# EAGLE schematic SOM204-EVB_Rev_C (EAGLE 4.16)
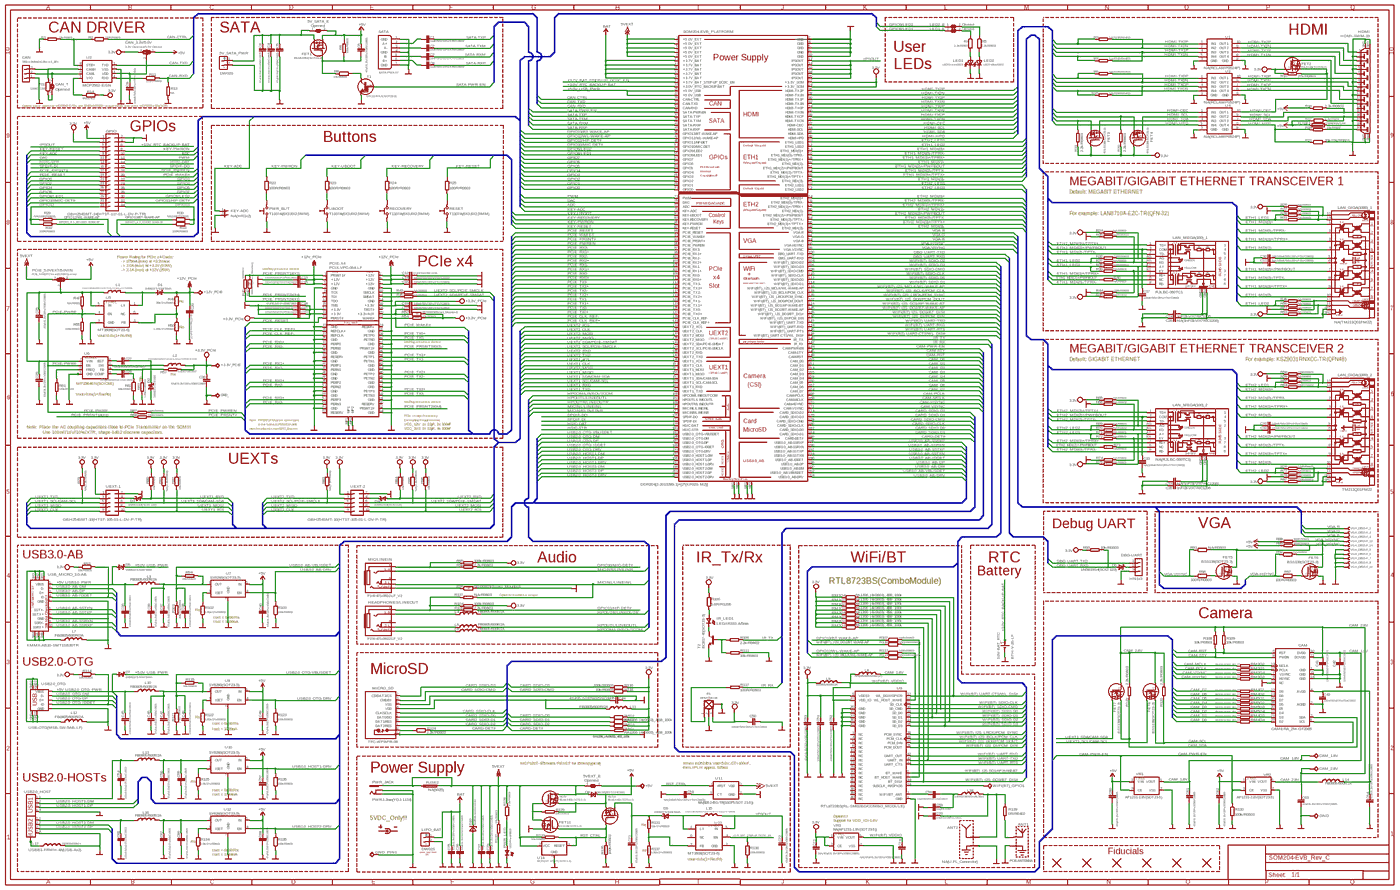
[diagram p0: schematic, sheet 1, overview]
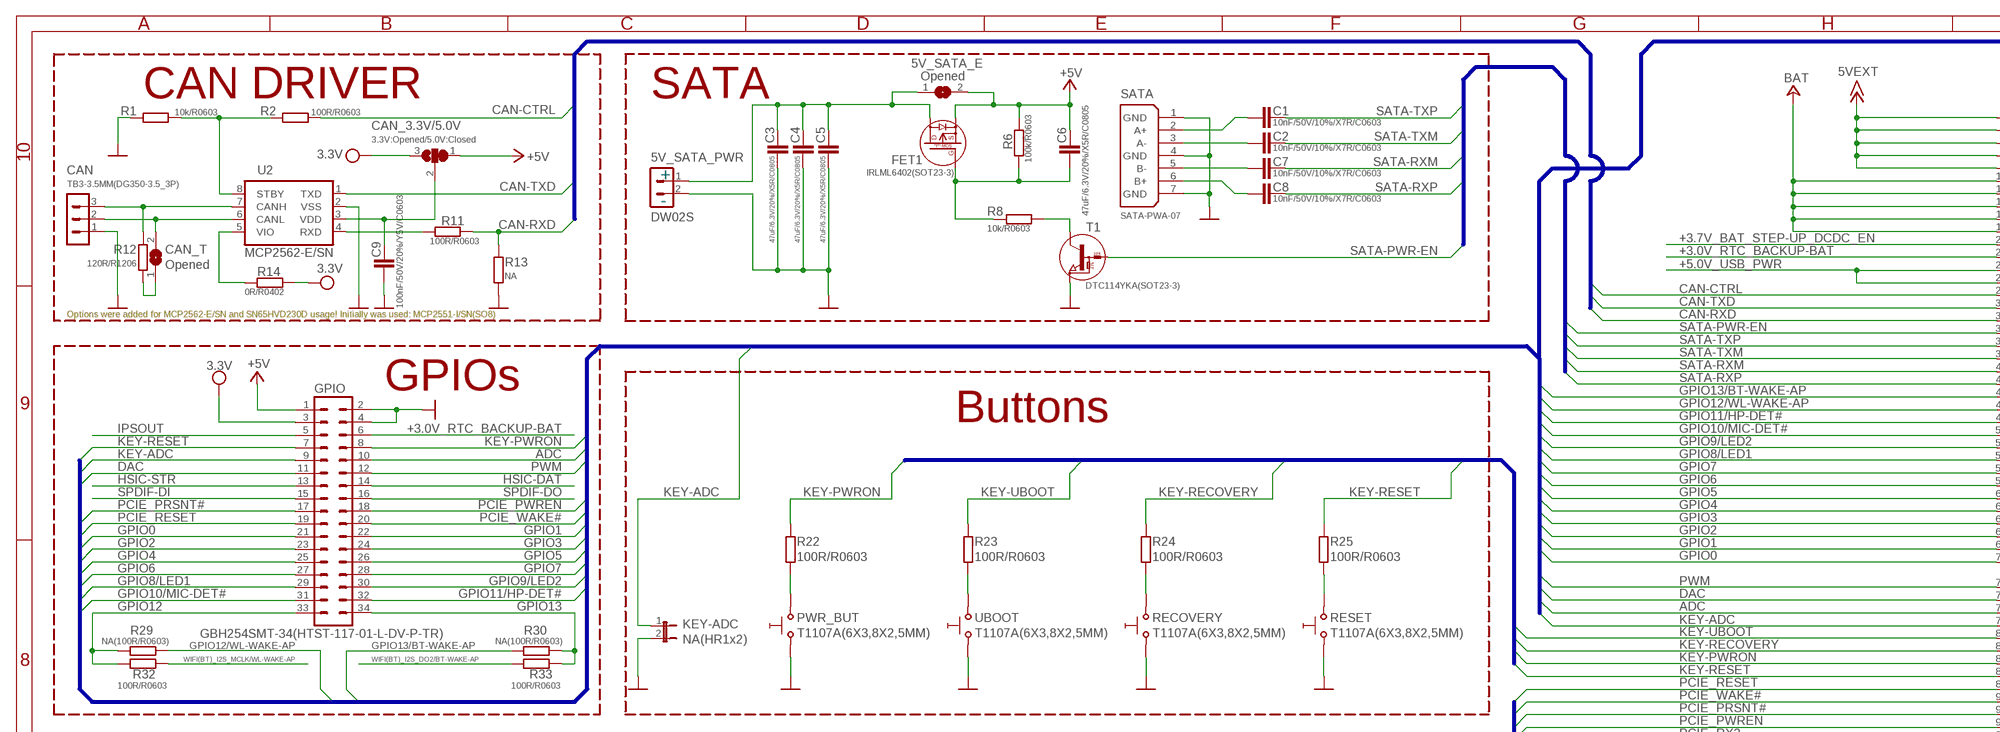
[diagram p1: schematic, sheet 1, part 1 of 4]
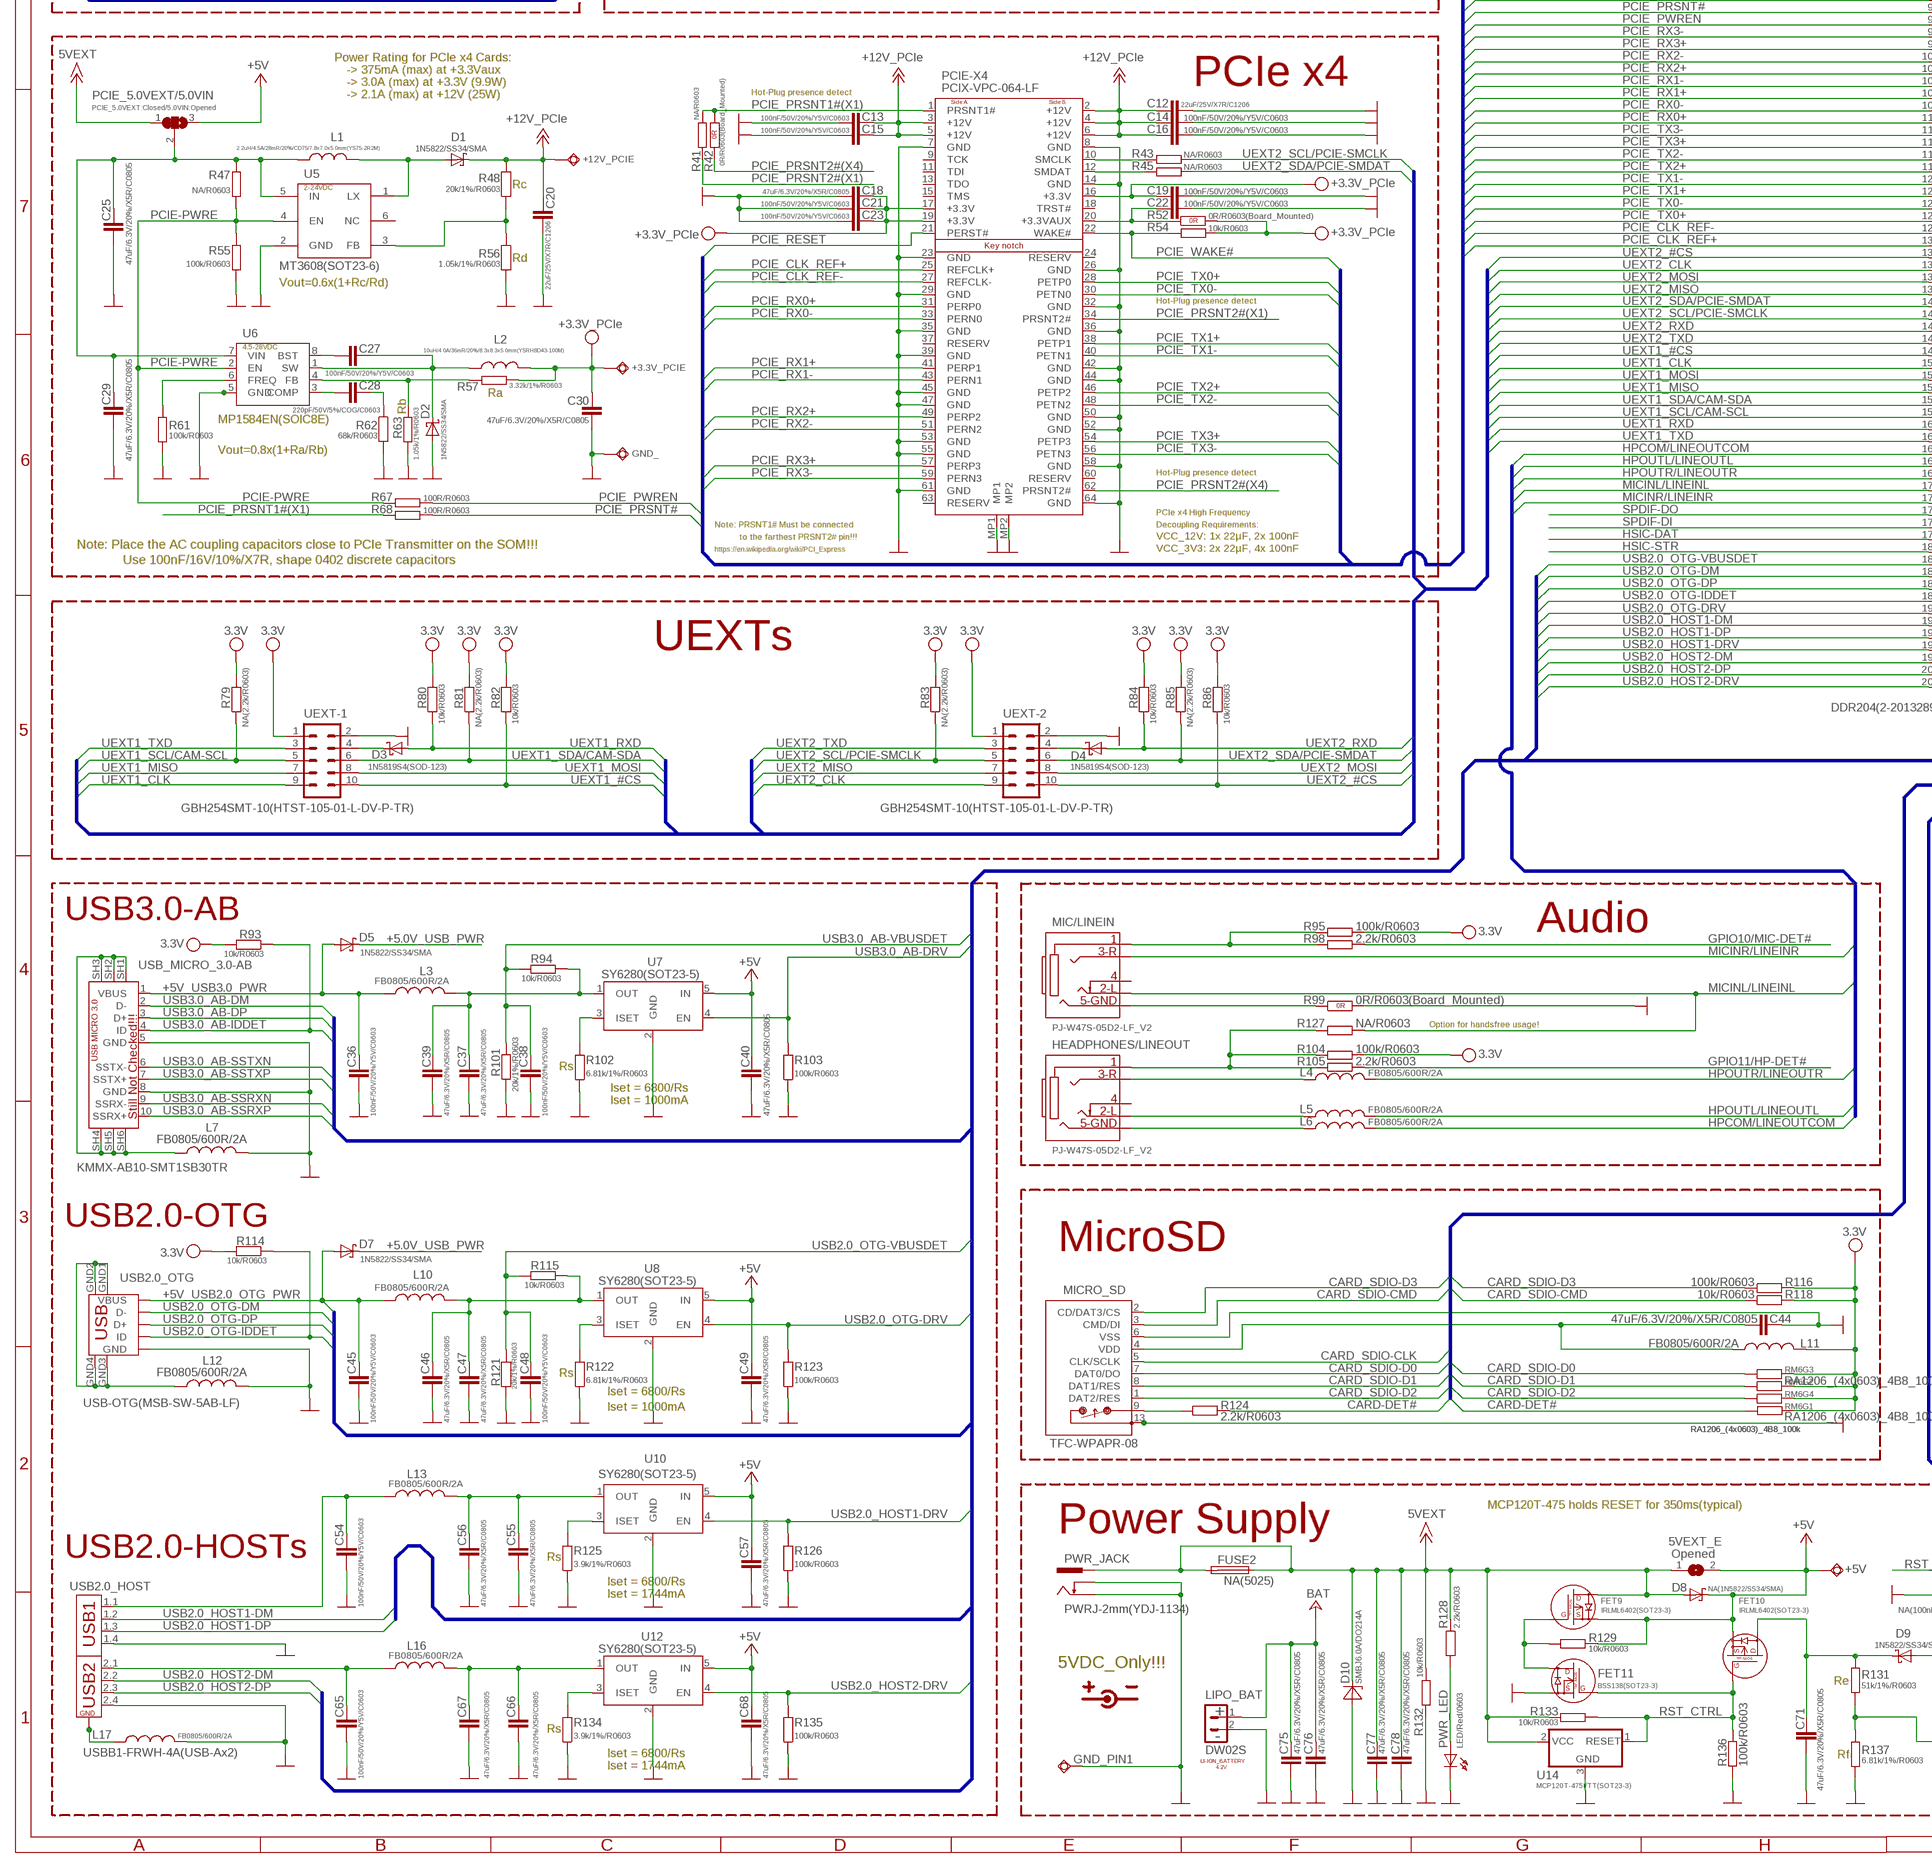
[diagram p2: schematic, sheet 1, part 2 of 4]
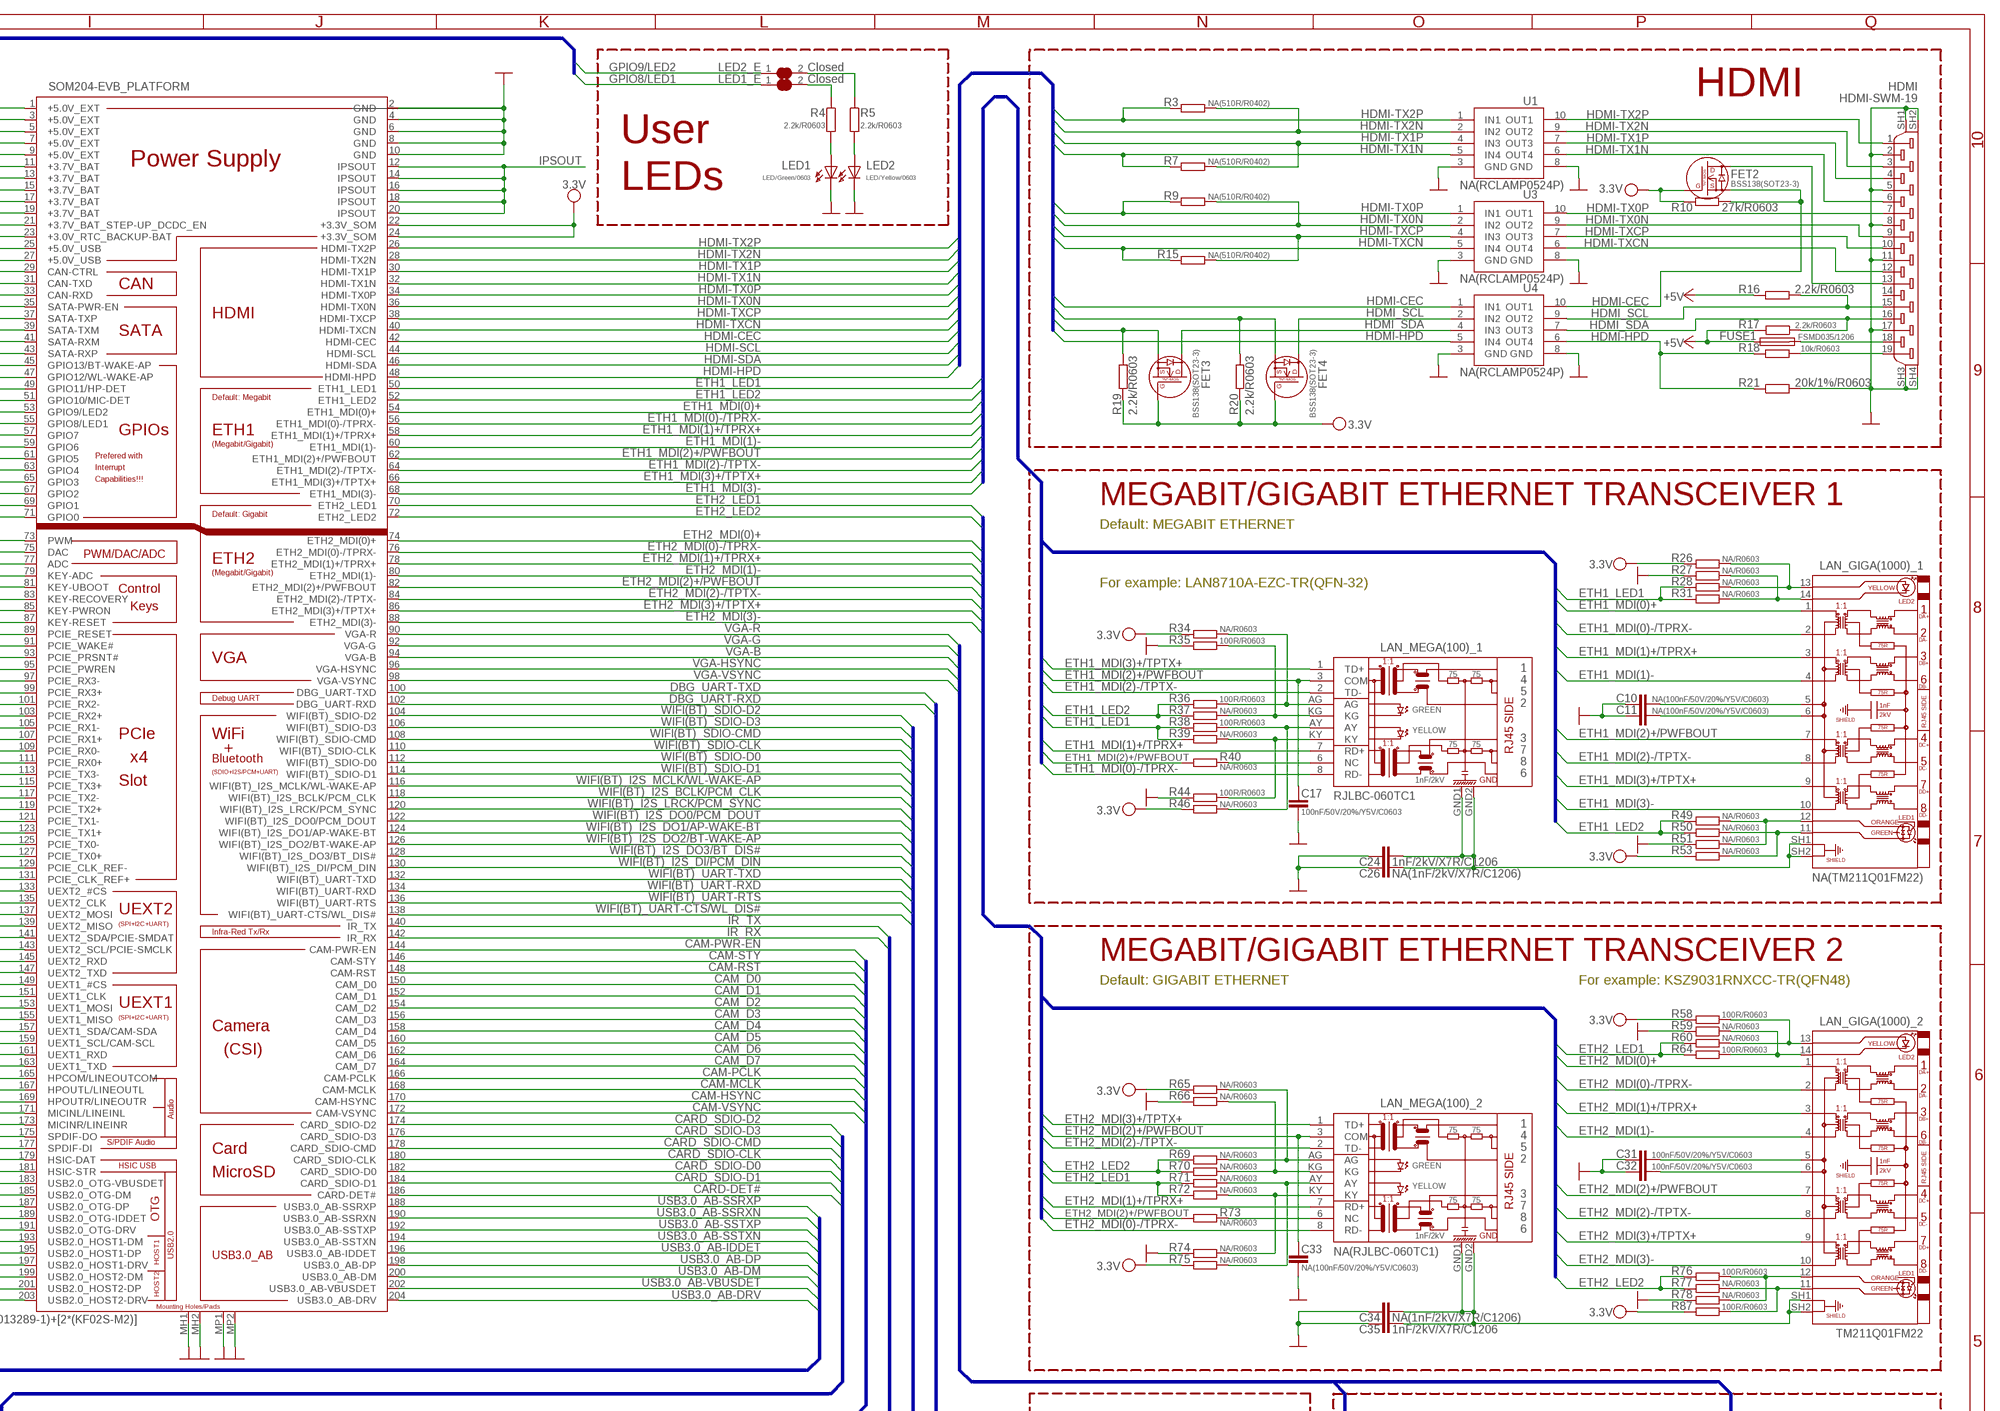
[diagram p3: schematic, sheet 1, part 3 of 4]
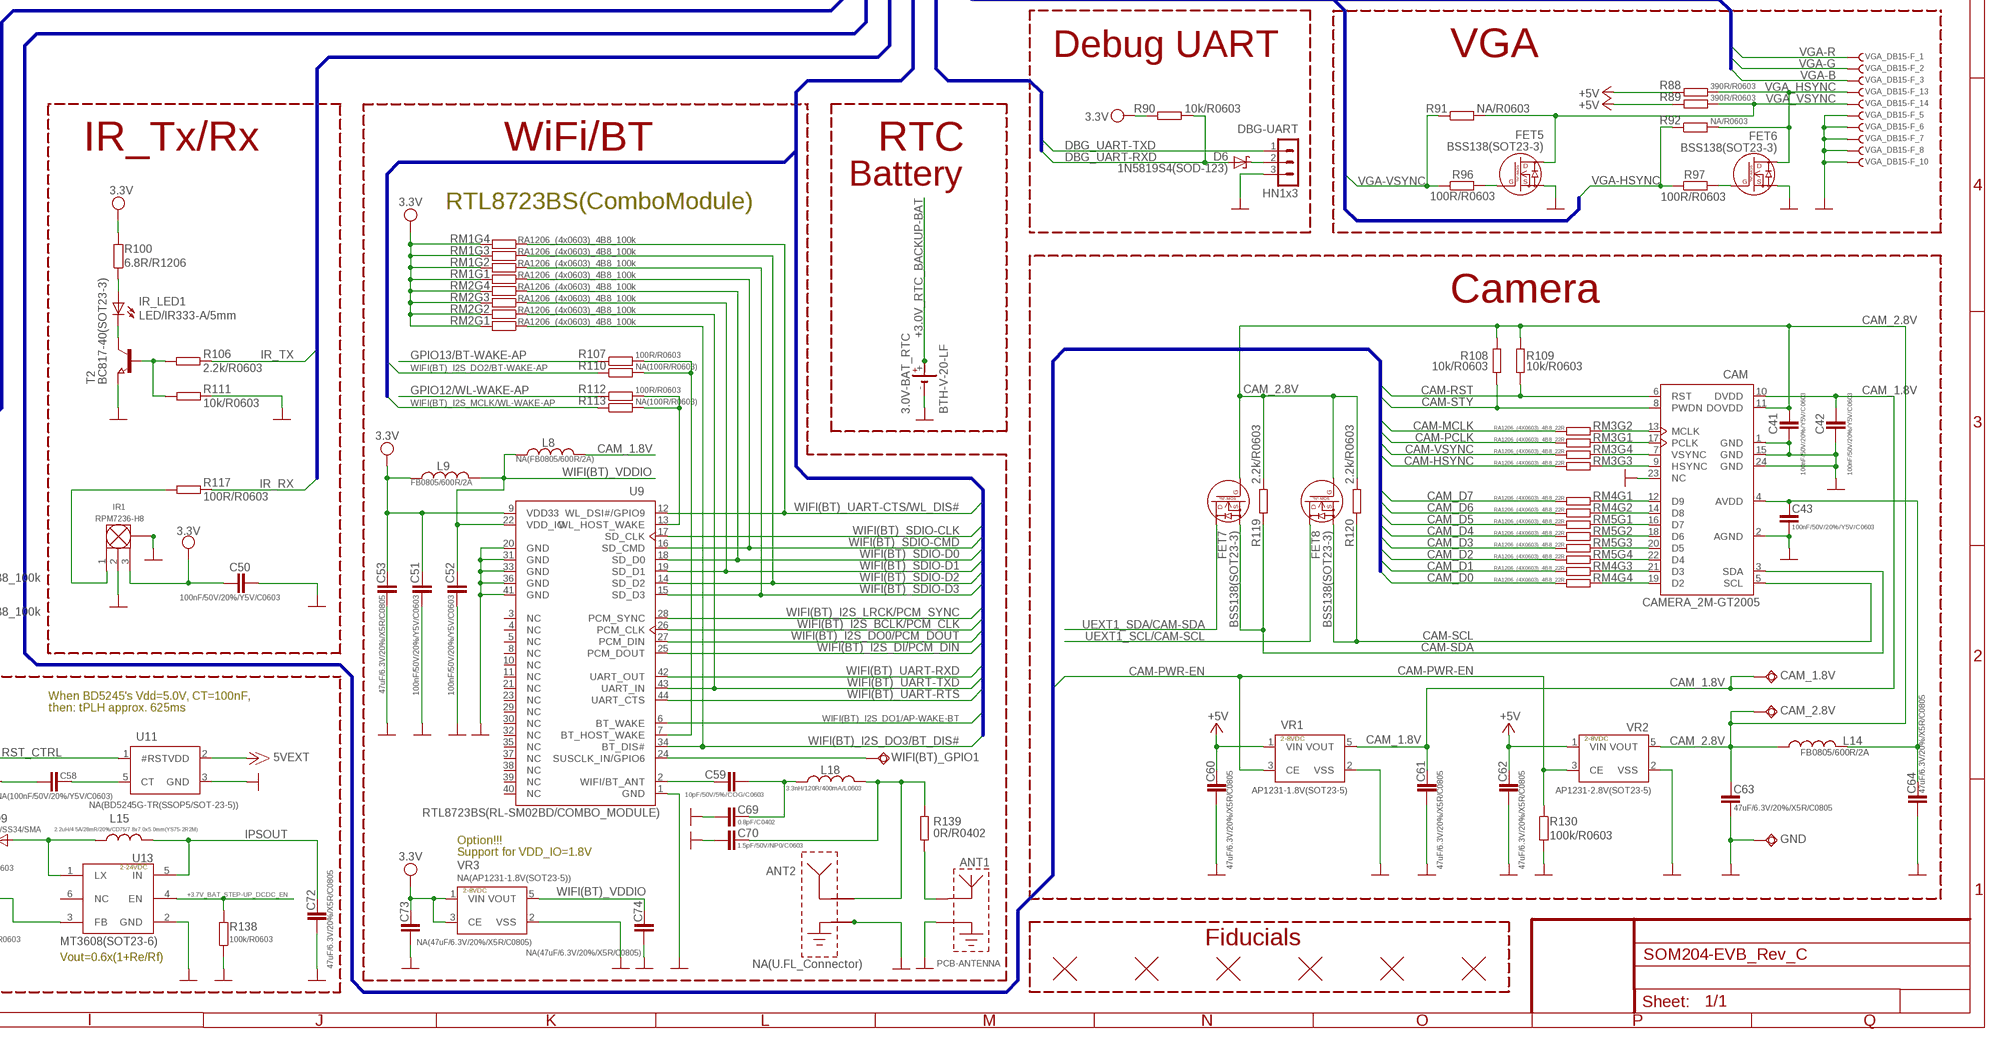
[diagram p4: schematic, sheet 1, part 4 of 4]

## Parts
3.0V-BAT_RTC  BTH-V-20-LF  BBTH-V-20-LF  [3V_BAT_HOLDER]
5V_SATA_E  Opened  SJ  [SJ]
5V_SATA_PWR  DW02S  CON2DW02S  [DW02S]
5VEXT_E  Opened  SJ  [SJ]
+3.3V_PCIE  TESTPADTESTPAD_40-ROUND  [TESTPAD_40-ROUND]
+5V  TESTPADTESTPAD_40-ROUND  [TESTPAD_40-ROUND]
+12V_PCIE  TESTPADTESTPAD_40-ROUND  [TESTPAD_40-ROUND]
ANT1  PCB-ANTENNA  ANTENNA_GNDM  [SMAL_SIZE-2.4GHZ_PCB_ANTENNA_MIRROR]
ANT2  NA(U.FL_Connector)  RF_CON  [RF_CONNECTOR_I-PEX]
C1  10nF/50V/10%/X7R/C0603  C-EUC0603_DWS  [C0603_DWS]
C2  10nF/50V/10%/X7R/C0603  C-EUC0603_DWS  [C0603_DWS]
C3  47uF/6.3V/20%/X5R/C0805  C-EUC0805_5MIL_DWS  [C0805_5MIL_DWS]
C4  47uF/6.3V/20%/X5R/C0805  C-EUC0805_5MIL_DWS  [C0805_5MIL_DWS]
C5  47uF/6.3V/20%/X5R/C0805  C-EUC0805_5MIL_DWS  [C0805_5MIL_DWS]
C6  47uF/6.3V/20%/X5R/C0805  C-EUC0805_5MIL_DWS  [C0805_5MIL_DWS]
C7  10nF/50V/10%/X7R/C0603  C-EUC0603_DWS  [C0603_DWS]
C8  10nF/50V/10%/X7R/C0603  C-EUC0603_DWS  [C0603_DWS]
C9  100nF/50V/20%/Y5V/C0603  C-EUC0603_DWS  [C0603_DWS]
C10  NA(100nF/50V/20%/Y5V/C0603)  C-EUC0603_DWS  [C0603_DWS]
C11  NA(100nF/50V/20%/Y5V/C0603)  C-EUC0603_DWS  [C0603_DWS]
C12  22uF/25V/X7R/C1206  C-EUC1206_5MIL_WS  [C1206_5MIL_WS]
C13  100nF/50V/20%/Y5V/C0603  C-EUC0603_DWS  [C0603_DWS]
C14  100nF/50V/20%/Y5V/C0603  C-EUC0603_DWS  [C0603_DWS]
C15  100nF/50V/20%/Y5V/C0603  C-EUC0603_DWS  [C0603_DWS]
C16  100nF/50V/20%/Y5V/C0603  C-EUC0603_DWS  [C0603_DWS]
C17  100nF/50V/20%/Y5V/C0603  C-EUC0603_DWS  [C0603_DWS]
C18  47uF/6.3V/20%/X5R/C0805  C-EUC0805_5MIL_DWS  [C0805_5MIL_DWS]
C19  100nF/50V/20%/Y5V/C0603  C-EUC0603_DWS  [C0603_DWS]
C20  22uF/25V/X7R/C1206  C-EUC1206_5MIL_WS  [C1206_5MIL_WS]
C21  100nF/50V/20%/Y5V/C0603  C-EUC0603_DWS  [C0603_DWS]
C22  100nF/50V/20%/Y5V/C0603  C-EUC0603_DWS  [C0603_DWS]
C23  100nF/50V/20%/Y5V/C0603  C-EUC0603_DWS  [C0603_DWS]
C24  1nF/2kV/X7R/C1206  C-EUC1206_5MILS_WS_ISO  [C1206_5MILS_WS_ISO]
C25  47uF/6.3V/20%/X5R/C0805  C-EUC0805_5MIL_DWS  [C0805_5MIL_DWS]
C26  NA(1nF/2kV/X7R/C1206)  C-EUC1206_5MILS_WS_ISO  [C1206_5MILS_WS_ISO]
C27  100nF/50V/20%/Y5V/C0603  C-EUC0603_DWS  [C0603_DWS]
C28  220pF/50V/5%/COG/C0603  C-EUC0603_DWS  [C0603_DWS]
C29  47uF/6.3V/20%/X5R/C0805  C-EUC0805_5MIL_DWS  [C0805_5MIL_DWS]
C30  47uF/6.3V/20%/X5R/C0805  C-EUC0805_5MIL_DWS  [C0805_5MIL_DWS]
C31  100nF/50V/20%/Y5V/C0603  C-EUC0603_DWS  [C0603_DWS]
C32  100nF/50V/20%/Y5V/C0603  C-EUC0603_DWS  [C0603_DWS]
C33  NA(100nF/50V/20%/Y5V/C0603)  C-EUC0603_DWS  [C0603_DWS]
C34  NA(1nF/2kV/X7R/C1206)  C-EUC1206_5MILS_WS_ISO  [C1206_5MILS_WS_ISO]
C35  1nF/2kV/X7R/C1206  C-EUC1206_5MILS_WS_ISO  [C1206_5MILS_WS_ISO]
C36  100nF/50V/20%/Y5V/C0603  C-EUC0603_DWS  [C0603_DWS]
C37  47uF/6.3V/20%/X5R/C0805  C-EUC0805_5MIL_DWS  [C0805_5MIL_DWS]
C38  100nF/50V/20%/Y5V/C0603  C-EUC0603_DWS  [C0603_DWS]
C39  47uF/6.3V/20%/X5R/C0805  C-EUC0805_5MIL_DWS  [C0805_5MIL_DWS]
C40  47uF/6.3V/20%/X5R/C0805  C-EUC0805_5MIL_DWS  [C0805_5MIL_DWS]
C41  100nF/50V/20%/Y5V/C0603  C-EUC0603_DWS  [C0603_DWS]
C42  100nF/50V/20%/Y5V/C0603  C-EUC0603_DWS  [C0603_DWS]
C43  100nF/50V/20%/Y5V/C0603  C-EUC0603_DWS  [C0603_DWS]
C44  47uF/6.3V/20%/X5R/C0805  C-EUC0805_5MIL_DWS  [C0805_5MIL_DWS]
C45  100nF/50V/20%/Y5V/C0603  C-EUC0603_DWS  [C0603_DWS]
C46  47uF/6.3V/20%/X5R/C0805  C-EUC0805_5MIL_DWS  [C0805_5MIL_DWS]
C47  47uF/6.3V/20%/X5R/C0805  C-EUC0805_5MIL_DWS  [C0805_5MIL_DWS]
C48  100nF/50V/20%/Y5V/C0603  C-EUC0603_DWS  [C0603_DWS]
C49  47uF/6.3V/20%/X5R/C0805  C-EUC0805_5MIL_DWS  [C0805_5MIL_DWS]
C50  100nF/50V/20%/Y5V/C0603  C-EUC0603_DWS  [C0603_DWS]
C51  100nF/50V/20%/Y5V/C0603  C-EUC0603_DWS  [C0603_DWS]
C52  100nF/50V/20%/Y5V/C0603  C-EUC0603_DWS  [C0603_DWS]
C53  47uF/6.3V/20%/X5R/C0805  C-EUC0805_5MIL_DWS  [C0805_5MIL_DWS]
C54  100nF/50V/20%/Y5V/C0603  C-EUC0603_DWS  [C0603_DWS]
C55  47uF/6.3V/20%/X5R/C0805  C-EUC0805_5MIL_DWS  [C0805_5MIL_DWS]
C56  47uF/6.3V/20%/X5R/C0805  C-EUC0805_5MIL_DWS  [C0805_5MIL_DWS]
C57  47uF/6.3V/20%/X5R/C0805  C-EUC0805_5MIL_DWS  [C0805_5MIL_DWS]
C58  NA(100nF/50V/20%/Y5V/C0603)  C-EUC0603_DWS  [C0603_DWS]
C59  10pF/50V/5%/COG/C0603  C-EUC0603_DWS  [C0603_DWS]
C60  47uF/6.3V/20%/X5R/C0805  C-EUC0805_5MIL_DWS  [C0805_5MIL_DWS]
C61  47uF/6.3V/20%/X5R/C0805  C-EUC0805_5MIL_DWS  [C0805_5MIL_DWS]
C62  47uF/6.3V/20%/X5R/C0805  C-EUC0805_5MIL_DWS  [C0805_5MIL_DWS]
C63  47uF/6.3V/20%/X5R/C0805  C-EUC0805_5MIL_DWS  [C0805_5MIL_DWS]
C64  47uF/6.3V/20%/X5R/C0805  C-EUC0805_5MIL_DWS  [C0805_5MIL_DWS]
C65  100nF/50V/20%/Y5V/C0603  C-EUC0603_DWS  [C0603_DWS]
C66  47uF/6.3V/20%/X5R/C0805  C-EUC0805_5MIL_DWS  [C0805_5MIL_DWS]
C67  47uF/6.3V/20%/X5R/C0805  C-EUC0805_5MIL_DWS  [C0805_5MIL_DWS]
C68  47uF/6.3V/20%/X5R/C0805  C-EUC0805_5MIL_DWS  [C0805_5MIL_DWS]
C69  0.8pF/C0402  C-EUC0402_TI  [C0402_TI]
C70  1.5pF/50V/NP0/C0603  C-EUC0603_DWS  [C0603_DWS]
C71  47uF/6.3V/20%/X5R/C0805  C-EUC0805_5MIL_DWS  [C0805_5MIL_DWS]
C72  47uF/6.3V/20%/X5R/C0805  C-EUC0805_5MIL_DWS  [C0805_5MIL_DWS]
C73  NA(47uF/6.3V/20%/X5R/C0805)  C-EUC0805_5MIL_DWS  [C0805_5MIL_DWS]
C74  NA(47uF/6.3V/20%/X5R/C0805)  C-EUC0805_5MIL_DWS  [C0805_5MIL_DWS]
C75  47uF/6.3V/20%/X5R/C0805  C-EUC0805_5MIL_DWS  [C0805_5MIL_DWS]
C76  47uF/6.3V/20%/X5R/C0805  C-EUC0805_5MIL_DWS  [C0805_5MIL_DWS]
C77  47uF/6.3V/20%/X5R/C0805  C-EUC0805_5MIL_DWS  [C0805_5MIL_DWS]
C78  47uF/6.3V/20%/X5R/C0805  C-EUC0805_5MIL_DWS  [C0805_5MIL_DWS]
CAM  CAMERA_2M-GT2005  [CAM_2M_GT2005]
CAM_1.8V  TESTPADTESTPAD_40-ROUND  [TESTPAD_40-ROUND]
CAM_2.8V  TESTPADTESTPAD_40-ROUND  [TESTPAD_40-ROUND]
CAN  TB3-3.5MM(DG350-3.5_3P)  CON3-DG350-3.5_3P(TB3-3.5MM)  [DG350-3.5_3P]
CAN_3.3V/5.0V  3.3V:Opened/5.0V:Closed  SJ2W6  [SJ_2_SMALL_12_TIED]
CAN_T  Opened  SJ  [SJ]
D1  1N5822/SS34/SMA  SCHOTKKY7.62SS2  [MLL-41]
D2  1N5822/SS34/SMA  SCHOTKKY7.62SS2  [MLL-41]
D3  1N5819S4(SOD-123)  SCHOTKKY7.62SS-1N5819(S4SOD-123)  [SOD-123]
D4  1N5819S4(SOD-123)  SCHOTKKY7.62SS-1N5819(S4SOD-123)  [SOD-123]
D5  1N5822/SS34/SMA  SCHOTKKY7.62SS2  [MLL-41]
D6  1N5819S4(SOD-123)  SCHOTKKY7.62SS-1N5819(S4SOD-123)  [SOD-123]
D7  1N5822/SS34/SMA  SCHOTKKY7.62SS2  [MLL-41]
D8  NA(1N5822/SS34/SMA)  SCHOTKKY7.62SS2  [MLL-41]
D9  1N5822/SS34/SMA  SCHOTKKY7.62SS2  [MLL-41]
D10  SMBJ6.0A/DO214A  SMBJ16A  [DO214AA]
DBG-UART  HN1x3  CON3HN1X3  [HN1X3]
FET1  IRLML6402(SOT23-3)  P-MOS+DIODIRLML6402  [SOT23]
FET2  BSS138(SOT23-3)  N-MOS+DIODBSS138(SOT23-3)  [SOT23]
FET3  BSS138(SOT23-3)  N-MOS+DIODBSS138(SOT23-3)  [SOT23]
FET4  BSS138(SOT23-3)  N-MOS+DIODBSS138(SOT23-3)  [SOT23]
FET5  BSS138(SOT23-3)  N-MOS+DIODBSS138(SOT23-3)  [SOT23]
FET6  BSS138(SOT23-3)  N-MOS+DIODBSS138(SOT23-3)  [SOT23]
FET7  BSS138(SOT23-3)  N-MOS+DIODBSS138(SOT23-3)  [SOT23]
FET8  BSS138(SOT23-3)  N-MOS+DIODBSS138(SOT23-3)  [SOT23]
FET9  IRLML6402(SOT23-3)  P-MOS+DIODIRLML6402  [SOT23]
FET10  IRLML6402(SOT23-3)  P-MOS+DIODIRLML6402  [SOT23]
FET11  BSS138(SOT23-3)  N-MOS+DIODBSS138(SOT23-3)  [SOT23]
FID1  FIDUCIAL  [FIDUCIAL-1X3]
FID2  FIDUCIAL  [FIDUCIAL-1X3]
FID3  FIDUCIAL  [FIDUCIAL-1X3]
FID4  FIDUCIAL  [FIDUCIAL-1X3]
FID5  FIDUCIAL  [FIDUCIAL-1X3]
FID6  FIDUCIAL  [FIDUCIAL-1X3]
FUSE1  FSMD035/1206  FUSE  [1206]
FUSE2  NA(5025)  FUSE""  [R5025]
GND  TESTPADTESTPAD_40-ROUND  [TESTPAD_40-ROUND]
GND_  TESTPADTESTPAD_40-ROUND  [TESTPAD_40-ROUND]
GND_PIN1  TESTPAD3  [TEST_PAD40/70/SQUARE]
GPIO  GBH254SMT-34(HTST-117-01-L-DV-P-TR)  ML34-(GBH-254-SMT-34)_TEST  [ML34-MALE(GBH-254-SMT-34)_TEST]
HDMI  HDMI-SWM-19  HDMI-MC34931HDMI-SWM-19  [HDMI-SWM-19]
HEADPHONES/LINEOUT  PJ-W47S-05D2-LF_V2  AUDIO_JACK_5PINPJ-W47S-05D2-LF_V2  [PJ-W47S-05D2-LF_5PIN_V2]
IR1  RPM7236-H8  RPM7236  [RPM7236]
IR_LED1  LED/IR333-A/5mm  LED5.0MM  [LED-5.0MM]
KEY-ADC  NA(HR1x2)  JP1EHR1X2  [JP1R]
L1  2.2uH/4.5A/28mR/20%/CD75/7.8x7.0x5.0mm(YS75-2R2M)  L-CD73(75)  [CD73(75)]
L2  10uH/4.0A/36mR/20%/8.3x8.3x5.0mm(YSRH8D43-100M)  L-CDRH8D43  [CDRH8D43]
L3  FB0805/600R/2A  L-USL0805_5MIL_DWS  [L0805_5MIL_DWS]
L4  FB0805/600R/2A  L-USL0805_5MIL_DWS  [L0805_5MIL_DWS]
L5  FB0805/600R/2A  L-USL0805_5MIL_DWS  [L0805_5MIL_DWS]
L6  FB0805/600R/2A  L-USL0805_5MIL_DWS  [L0805_5MIL_DWS]
L7  FB0805/600R/2A  L-USL0805_5MIL_DWS  [L0805_5MIL_DWS]
L8  NA(FB0805/600R/2A)  L-USL0805_5MIL_DWS  [L0805_5MIL_DWS]
L9  FB0805/600R/2A  L-USL0805_5MIL_DWS  [L0805_5MIL_DWS]
L10  FB0805/600R/2A  L-USL0805_5MIL_DWS  [L0805_5MIL_DWS]
L11  FB0805/600R/2A  L-USL0805_5MIL_DWS  [L0805_5MIL_DWS]
L12  FB0805/600R/2A  L-USL0805_5MIL_DWS  [L0805_5MIL_DWS]
L13  FB0805/600R/2A  L-USL0805_5MIL_DWS  [L0805_5MIL_DWS]
L14  FB0805/600R/2A  L-USL0805_5MIL_DWS  [L0805_5MIL_DWS]
L15  2.2uH/4.5A/28mR/20%/CD75/7.8x7.0x5.0mm(YS75-2R2M)  L-CD73(75)  [CD73(75)]
L16  FB0805/600R/2A  L-USL0805_5MIL_DWS  [L0805_5MIL_DWS]
L17  FB0805/600R/2A  L-USL0805_5MIL_DWS  [L0805_5MIL_DWS]
L18  3.3nH/120R/400mA/L0603  L-USL0603_5MIL_DWS  [L0603_5MIL_DWS]
LAN_GIGA(1000)_1  NA(TM211Q01FM22)  TM211Q01FM22_SH  [TM211Q01FM22_SH]
LAN_GIGA(1000)_2  TM211Q01FM22  TM211Q01FM22_SH  [TM211Q01FM22_SH]
LAN_MEGA(100)_1  RJLBC-060TC1  RJLBC-060TC1_GND_MILLING  [RJLBC-060TC1_MILLING]
LAN_MEGA(100)_2  NA(RJLBC-060TC1)  RJLBC-060TC1_GND_MILLING  [RJLBC-060TC1_MILLING]
LED1  LED/Green/0603  LEDLED-0603_TEST  [LED-0603_TEST]
LED1_E  Closed  SJSJ-CLOSE  [SJ-CLOSE]
LED2  LED/Yellow/0603  LEDLED-0603_TEST  [LED-0603_TEST]
LED2_E  Closed  SJSJ-CLOSE  [SJ-CLOSE]
LIPO_BAT  DW02S  CON2DW02S  [DW02S]
MIC/LINEIN  PJ-W47S-05D2-LF_V2  AUDIO_JACK_5PINPJ-W47S-05D2-LF_V2  [PJ-W47S-05D2-LF_5PIN_V2]
MICRO_SD  TFC-WPAPR-08  MICRO_SD/MMC_CP_NEWTFC-WPAPR-08  [TFC-WPAPR-08]
PCIE-X4  PCIX-VPC-064-LF  PCIE-X4_CONNECTOR(PCIX-VPC-064-LF)  [PCIX-VPC-064-LF]
PCIE_5.0VEXT/5.0VIN  PCIE_5.0VEXT:Closed/5.0VIN:Opened  SJ2W6  [SJ_2_SMALL_12_TIED]
PWR_BUT  T1107A(6X3,8X2,5MM)  SW-TAKTT1107A(6X3,8X2,5MM)  [WS-TAKT_6X3.5_SMD_NOCREAM]
PWR_JACK  PWRJ-2mm(YDJ-1134)  PWR-JAKPWR_JACK_UNI_MILLING  [PWR_JACK_UNI_MILLING]
PWR_LED  LED/Red/0603  LEDLED-0603_TEST  [LED-0603_TEST]
R1  10k/R0603  R-EU_R0603_5MIL_DWS  [R0603_5MIL_DWS]
R2  100R/R0603  R-EU_R0603_5MIL_DWS  [R0603_5MIL_DWS]
R3  NA(510R/R0402)  R-EU_R0402_SMALL  [R0402_SMALL]
R4  2.2k/R0603  R-EU_R0603_5MIL_DWS  [R0603_5MIL_DWS]
R5  2.2k/R0603  R-EU_R0603_5MIL_DWS  [R0603_5MIL_DWS]
R6  100k/R0603  R-EU_R0603_5MIL_DWS  [R0603_5MIL_DWS]
R7  NA(510R/R0402)  R-EU_R0402_SMALL  [R0402_SMALL]
R8  10k/R0603  R-EU_R0603_5MIL_DWS  [R0603_5MIL_DWS]
R9  NA(510R/R0402)  R-EU_R0402_SMALL  [R0402_SMALL]
R10  27k/R0603  R-EU_R0603_5MIL_DWS  [R0603_5MIL_DWS]
R11  100R/R0603  R-EU_R0603_5MIL_DWS  [R0603_5MIL_DWS]
R12  120R/R1206  R-EU_R1206_5MIL_WS  [R1206_5MIL_WS]
R13  NA  R-EU_R0603_5MIL_DWS  [R0603_5MIL_DWS]
R14  0R/R0402  R-EU_R0402_SMALL  [R0402_SMALL]
R15  NA(510R/R0402)  R-EU_R0402_SMALL  [R0402_SMALL]
R16  2.2k/R0603  R-EU_R0603_5MIL_DWS  [R0603_5MIL_DWS]
R17  2.2k/R0603  R-EU_R0603_5MIL_DWS  [R0603_5MIL_DWS]
R18  10k/R0603  R-EU_R0603_5MIL_DWS  [R0603_5MIL_DWS]
R19  2.2k/R0603  R-EU_R0603_5MIL_DWS  [R0603_5MIL_DWS]
R20  2.2k/R0603  R-EU_R0603_5MIL_DWS  [R0603_5MIL_DWS]
R21  20k/1%/R0603  R-EU_R0603_5MIL_DWS  [R0603_5MIL_DWS]
R22  100R/R0603  R-EU_R0603_5MIL_DWS  [R0603_5MIL_DWS]
R23  100R/R0603  R-EU_R0603_5MIL_DWS  [R0603_5MIL_DWS]
R24  100R/R0603  R-EU_R0603_5MIL_DWS  [R0603_5MIL_DWS]
R25  100R/R0603  R-EU_R0603_5MIL_DWS  [R0603_5MIL_DWS]
R26  NA/R0603  R-EU_R0603_5MIL_DWS  [R0603_5MIL_DWS]
R27  NA/R0603  R-EU_R0603_5MIL_DWS  [R0603_5MIL_DWS]
R28  NA/R0603  R-EU_R0603_5MIL_DWS  [R0603_5MIL_DWS]
R29  NA(100R/R0603)  R-EU_R0603_5MIL_DWS  [R0603_5MIL_DWS]
R30  NA(100R/R0603)  R-EU_R0603_5MIL_DWS  [R0603_5MIL_DWS]
R31  NA/R0603  R-EU_R0603_5MIL_DWS  [R0603_5MIL_DWS]
R32  100R/R0603  R-EU_R0603_5MIL_DWS  [R0603_5MIL_DWS]
R33  100R/R0603  R-EU_R0603_5MIL_DWS  [R0603_5MIL_DWS]
R34  NA/R0603  R-EU_R0603_5MIL_DWS  [R0603_5MIL_DWS]
R35  100R/R0603  R-EU_R0603_5MIL_DWS  [R0603_5MIL_DWS]
R36  100R/R0603  R-EU_R0603_5MIL_DWS  [R0603_5MIL_DWS]
R37  NA/R0603  R-EU_R0603_5MIL_DWS  [R0603_5MIL_DWS]
R38  100R/R0603  R-EU_R0603_5MIL_DWS  [R0603_5MIL_DWS]
R39  NA/R0603  R-EU_R0603_5MIL_DWS  [R0603_5MIL_DWS]
R40  NA/R0603  R-EU_R0603_5MIL_DWS  [R0603_5MIL_DWS]
R41  NA/R0603  R-EU_R0603_5MIL_DWS  [R0603_5MIL_DWS]
R42  0R/R0603(Board_Mounted)  R_0R0R(NA)  [0603_0R]
R43  NA/R0603  R-EU_R0603_5MIL_DWS  [R0603_5MIL_DWS]
R44  100R/R0603  R-EU_R0603_5MIL_DWS  [R0603_5MIL_DWS]
R45  NA/R0603  R-EU_R0603_5MIL_DWS  [R0603_5MIL_DWS]
R46  NA/R0603  R-EU_R0603_5MIL_DWS  [R0603_5MIL_DWS]
R47  NA/R0603  R-EU_R0603_5MIL_DWS  [R0603_5MIL_DWS]
R48  20k/1%/R0603  R-EU_R0603_5MIL_DWS  [R0603_5MIL_DWS]
R49  NA/R0603  R-EU_R0603_5MIL_DWS  [R0603_5MIL_DWS]
R50  NA/R0603  R-EU_R0603_5MIL_DWS  [R0603_5MIL_DWS]
R51  NA/R0603  R-EU_R0603_5MIL_DWS  [R0603_5MIL_DWS]
R52  0R/R0603(Board_Mounted)  R_0R0R(NA)  [0603_0R]
R53  NA/R0603  R-EU_R0603_5MIL_DWS  [R0603_5MIL_DWS]
R54  10k/R0603  R-EU_R0603_5MIL_DWS  [R0603_5MIL_DWS]
R55  100k/R0603  R-EU_R0603_5MIL_DWS  [R0603_5MIL_DWS]
R56  1.05k/1%/R0603  R-EU_R0603_5MIL_DWS  [R0603_5MIL_DWS]
R57  3.32k/1%/R0603  R-EU_R0603_5MIL_DWS  [R0603_5MIL_DWS]
R58  100R/R0603  R-EU_R0603_5MIL_DWS  [R0603_5MIL_DWS]
R59  NA/R0603  R-EU_R0603_5MIL_DWS  [R0603_5MIL_DWS]
R60  NA/R0603  R-EU_R0603_5MIL_DWS  [R0603_5MIL_DWS]
R61  100k/R0603  R-EU_R0603_5MIL_DWS  [R0603_5MIL_DWS]
R62  68k/R0603  R-EU_R0603_5MIL_DWS  [R0603_5MIL_DWS]
R63  1.05k/1%/R0603  R-EU_R0603_5MIL_DWS  [R0603_5MIL_DWS]
R64  100R/R0603  R-EU_R0603_5MIL_DWS  [R0603_5MIL_DWS]
R65  NA/R0603  R-EU_R0603_5MIL_DWS  [R0603_5MIL_DWS]
R66  NA/R0603  R-EU_R0603_5MIL_DWS  [R0603_5MIL_DWS]
R67  100R/R0603  R-EU_R0603_5MIL_DWS  [R0603_5MIL_DWS]
R68  100R/R0603  R-EU_R0603_5MIL_DWS  [R0603_5MIL_DWS]
R69  NA/R0603  R-EU_R0603_5MIL_DWS  [R0603_5MIL_DWS]
R70  NA/R0603  R-EU_R0603_5MIL_DWS  [R0603_5MIL_DWS]
R71  NA/R0603  R-EU_R0603_5MIL_DWS  [R0603_5MIL_DWS]
R72  NA/R0603  R-EU_R0603_5MIL_DWS  [R0603_5MIL_DWS]
R73  NA/R0603  R-EU_R0603_5MIL_DWS  [R0603_5MIL_DWS]
R74  NA/R0603  R-EU_R0603_5MIL_DWS  [R0603_5MIL_DWS]
R75  NA/R0603  R-EU_R0603_5MIL_DWS  [R0603_5MIL_DWS]
R76  100R/R0603  R-EU_R0603_5MIL_DWS  [R0603_5MIL_DWS]
R77  NA/R0603  R-EU_R0603_5MIL_DWS  [R0603_5MIL_DWS]
R78  NA/R0603  R-EU_R0603_5MIL_DWS  [R0603_5MIL_DWS]
R79  NA(2.2k/R0603)  R-EU_R0603_5MIL_DWS  [R0603_5MIL_DWS]
R80  10k/R0603  R-EU_R0603_5MIL_DWS  [R0603_5MIL_DWS]
R81  NA(2.2k/R0603)  R-EU_R0603_5MIL_DWS  [R0603_5MIL_DWS]
R82  10k/R0603  R-EU_R0603_5MIL_DWS  [R0603_5MIL_DWS]
R83  NA(2.2k/R0603)  R-EU_R0603_5MIL_DWS  [R0603_5MIL_DWS]
R84  10k/R0603  R-EU_R0603_5MIL_DWS  [R0603_5MIL_DWS]
R85  NA(2.2k/R0603)  R-EU_R0603_5MIL_DWS  [R0603_5MIL_DWS]
R86  10k/R0603  R-EU_R0603_5MIL_DWS  [R0603_5MIL_DWS]
R87  100R/R0603  R-EU_R0603_5MIL_DWS  [R0603_5MIL_DWS]
R88  390R/R0603  R-EU_R0603_5MIL_DWS  [R0603_5MIL_DWS]
R89  390R/R0603  R-EU_R0603_5MIL_DWS  [R0603_5MIL_DWS]
R90  10k/R0603  R-EU_R0603_5MIL_DWS  [R0603_5MIL_DWS]
R91  NA/R0603  R-EU_R0603_5MIL_DWS  [R0603_5MIL_DWS]
R92  NA/R0603  R-EU_R0603_5MIL_DWS  [R0603_5MIL_DWS]
R93  10k/R0603  R-EU_R0603_5MIL_DWS  [R0603_5MIL_DWS]
R94  10k/R0603  R-EU_R0603_5MIL_DWS  [R0603_5MIL_DWS]
R95  100k/R0603  R-EU_R0603_5MIL_DWS  [R0603_5MIL_DWS]
R96  100R/R0603  R-EU_R0603_5MIL_DWS  [R0603_5MIL_DWS]
R97  100R/R0603  R-EU_R0603_5MIL_DWS  [R0603_5MIL_DWS]
R98  2.2k/R0603  R-EU_R0603_5MIL_DWS  [R0603_5MIL_DWS]
R99  0R/R0603(Board_Mounted)  R_0R0R(NA)  [0603_0R]
R100  6.8R/R1206  R-EU_R1206_5MIL  [R1206_5MIL]
R101  20k/1%/R0603  R-EU_R0603_5MIL_DWS  [R0603_5MIL_DWS]
R102  6.81k/1%/R0603  R-EU_R0603_5MIL_DWS  [R0603_5MIL_DWS]
R103  100k/R0603  R-EU_R0603_5MIL_DWS  [R0603_5MIL_DWS]
R104  100k/R0603  R-EU_R0603_5MIL_DWS  [R0603_5MIL_DWS]
R105  2.2k/R0603  R-EU_R0603_5MIL_DWS  [R0603_5MIL_DWS]
R106  2.2k/R0603  R-EU_R0603_5MIL_DWS  [R0603_5MIL_DWS]
R107  100R/R0603  R-EU_R0603_5MIL_DWS  [R0603_5MIL_DWS]
R108  10k/R0603  R-EU_R0603_5MIL_DWS  [R0603_5MIL_DWS]
R109  10k/R0603  R-EU_R0603_5MIL_DWS  [R0603_5MIL_DWS]
R110  NA(100R/R0603)  R-EU_R0603_5MIL_DWS  [R0603_5MIL_DWS]
R111  10k/R0603  R-EU_R0603_5MIL_DWS  [R0603_5MIL_DWS]
R112  100R/R0603  R-EU_R0603_5MIL_DWS  [R0603_5MIL_DWS]
R113  NA(100R/R0603)  R-EU_R0603_5MIL_DWS  [R0603_5MIL_DWS]
R114  10k/R0603  R-EU_R0603_5MIL_DWS  [R0603_5MIL_DWS]
R115  10k/R0603  R-EU_R0603_5MIL_DWS  [R0603_5MIL_DWS]
R116  100k/R0603  R-EU_R0603_5MIL_DWS  [R0603_5MIL_DWS]
R117  100R/R0603  R-EU_R0603_5MIL_DWS  [R0603_5MIL_DWS]
R118  10k/R0603  R-EU_R0603_5MIL_DWS  [R0603_5MIL_DWS]
R119  2.2k/R0603  R-EU_R0603_5MIL_DWS  [R0603_5MIL_DWS]
R120  2.2k/R0603  R-EU_R0603_5MIL_DWS  [R0603_5MIL_DWS]
R121  20k/1%/R0603  R-EU_R0603_5MIL_DWS  [R0603_5MIL_DWS]
R122  6.81k/1%/R0603  R-EU_R0603_5MIL_DWS  [R0603_5MIL_DWS]
R123  100k/R0603  R-EU_R0603_5MIL_DWS  [R0603_5MIL_DWS]
R124  2.2k/R0603  R-EU_R0603_5MIL_DWS  [R0603_5MIL_DWS]
R125  3.9k/1%/R0603  R-EU_R0603_5MIL_DWS  [R0603_5MIL_DWS]
R126  100k/R0603  R-EU_R0603_5MIL_DWS  [R0603_5MIL_DWS]
R127  NA/R0603  R-EU_R0603_5MIL_DWS  [R0603_5MIL_DWS]
R128  2.2k/R0603  R-EU_R0603_5MIL_DWS  [R0603_5MIL_DWS]
R129  10k/R0603  R-EU_R0603_5MIL_DWS  [R0603_5MIL_DWS]
R130  100k/R0603  R-EU_R0603_5MIL_DWS  [R0603_5MIL_DWS]
R131  51k/1%/R0603  R-EU_R0603_5MIL_DWS  [R0603_5MIL_DWS]
R132  10k/R0603  R-EU_R0603_5MIL_DWS  [R0603_5MIL_DWS]
R133  10k/R0603  R-EU_R0603_5MIL_DWS  [R0603_5MIL_DWS]
R134  3.9k/1%/R0603  R-EU_R0603_5MIL_DWS  [R0603_5MIL_DWS]
R135  100k/R0603  R-EU_R0603_5MIL_DWS  [R0603_5MIL_DWS]
R136  100k/R0603  R-EU_R0603_5MIL_DWS  [R0603_5MIL_DWS]
R137  6.81k/1%/R0603  R-EU_R0603_5MIL_DWS  [R0603_5MIL_DWS]
R138  100k/R0603  R-EU_R0603_5MIL_DWS  [R0603_5MIL_DWS]
R139  0R/R0402  R-EU_R0402_SMALL  [R0402_SMALL]
RECOVERY  T1107A(6X3,8X2,5MM)  SW-TAKTT1107A(6X3,8X2,5MM)  [WS-TAKT_6X3.5_SMD_NOCREAM]
RESET  T1107A(6X3,8X2,5MM)  SW-TAKTT1107A(6X3,8X2,5MM)  [WS-TAKT_6X3.5_SMD_NOCREAM]
RM1  RA1206_(4x0603)_4B8_100k  R_MATRIX_4E  [R_MATRIX_4]
RM2  RA1206_(4x0603)_4B8_100k  R_MATRIX_4E  [R_MATRIX_4]
RM3  RA1206_(4X0603)_4B8_22R  R_MATRIX_4E  [R_MATRIX_4]
RM4  RA1206_(4X0603)_4B8_22R  R_MATRIX_4E  [R_MATRIX_4]
RM5  RA1206_(4X0603)_4B8_22R  R_MATRIX_4E  [R_MATRIX_4]
RM6  RA1206_(4x0603)_4B8_100k  R_MATRIX_4E  [R_MATRIX_4]
SATA  SATA-PWA-07  SATA-PWA-07"  [SATA-PWA-07]
SOM204-EVB_PLATFORM  DDR204(2-2013289-1)+[2*(KF02S-M2)]  SOM204-EVB-DDR204(2-2013289-1)  [DDR204(2-2013289-1)]
T1  DTC114YKA(SOT23-3)  DIGITAL_TRANSISTORS-NPNDTC114YKA  [SOT-23]
T2  BC817-40(SOT23-3)  NPN-TRANSISTOR_SOT23  [SOT23]
U1  NA(RCLAMP0524P)  RCLAMP0524PTEST  [SLP2510P8_TEST]
U2  MCP2562-E/SN  [SO-08_THIN]
U3  NA(RCLAMP0524P)  RCLAMP0524PTEST  [SLP2510P8_TEST]
U4  NA(RCLAMP0524P)  RCLAMP0524PTEST  [SLP2510P8_TEST]
U5  MT3608(SOT23-6)  SY7208  [SOT23-6]
U6  MP1584EN(SOIC8E)  [SOIC8E]
U7  SY6280(SOT23-5)  SY6280  [SOT23-5]
U8  SY6280(SOT23-5)  SY6280  [SOT23-5]
U9  RTL8723BS(RL-SM02BD/COMBO_MODULE)  RTL8723BS(COMBO_MODULE)-(RL-SM02BD)  [RL-SM02BD(RTL8723BS)]
U10  SY6280(SOT23-5)  SY6280  [SOT23-5]
U11  NA(BD5245G-TR(SSOP5/SOT-23-5))  BD5230G-TR(SSOP5/SOT-23-5)  [SOT23-5]
U12  SY6280(SOT23-5)  SY6280  [SOT23-5]
U13  MT3608(SOT23-6)  SY7208  [SOT23-6]
U14  MCP120T-475I/TT(SOT23-3)  RESETMCP130T-300-I/TT  [SOT23]
UBOOT  T1107A(6X3,8X2,5MM)  SW-TAKTT1107A(6X3,8X2,5MM)  [WS-TAKT_6X3.5_SMD_NOCREAM]
UEXT-1  GBH254SMT-10(HTST-105-01-L-DV-P-TR)  ML10-(GBH-254-SMT-10)_TEST  [ML10-MALE(GBH-254-SMT-10)_TEST]
UEXT-2  GBH254SMT-10(HTST-105-01-L-DV-P-TR)  ML10-(GBH-254-SMT-10)_TEST  [ML10-MALE(GBH-254-SMT-10)_TEST]
USB2.0_HOST  USBB1-FRWH-4A(USB-Ax2)  USB_TWO_LEVEL  [USB_TWO_LEVEL]
USB2.0_OTG  USB-OTG(MSB-SW-5AB-LF)  MINI_USB9  [USB_MINI_9PIN]
USB_MICRO_3.0-AB  KMMX-AB10-SMT1SB30TR  USB_MICRO_3.0-KMMX-AB10-SMT1SB30TR  [USB_MICRO_3.0]
VGA_DB15-F  VGA15(DB15-F)  DB1522  [DB15-F_22MM]
VR1  AP1231-1.8V(SOT23-5)  AP1231-33  [SOT-23-5]
VR2  AP1231-2.8V(SOT23-5)  AP1231-33  [SOT-23-5]
VR3  NA(AP1231-1.8V(SOT23-5))  AP1231-33  [SOT-23-5]
WIFI(BT)_GPIO1  WiFi(BT)_GPIO6  TESTPADTESTPAD_40-ROUND  [TESTPAD_40-ROUND]

## Nets
+3.0V_RTC_BACKUP-BAT: 3.0V-BAT_RTC.1+(+) 3.0V-BAT_RTC.+ GPIO.6 SOM204-EVB_PLATFORM.23(+3.0V_RTC_BACKUP-BAT)
+3.3VAUX: C22.1 PCIE-X4.20(+3.3VAUX) R52.1(1.1)
+3.7V_BAT_STEP-UP_DCDC_EN: R138.2 SOM204-EVB_PLATFORM.21(+3.7V_BAT_STEP-UP_DCDC_EN) U13.4(EN)
+5.0V_USB_PWR: D5.K(C) D7.K(C) SOM204-EVB_PLATFORM.25(+5.0V_USB) SOM204-EVB_PLATFORM.27(+5.0V_USB)
+5V: 5V_SATA_E.2 5VEXT_E.2 +5V.1(PP) C6.2 C40.2 C49.2 C57.2 C60.2 C62.2 C68.2 CAN_3.3V/5.0V.1 D8.K(C) FET1.2(S) FET9.2(S) FET10.2(S) FUSE1.1 GPIO.1 PCIE_5.0VEXT/5.0VIN.3 R6.1 R16.2 R17.2 R88.1 R89.1 R129.1 U7.5(IN) U8.5(IN) U10.5(IN) U12.5(IN) VR1.1(VIN) VR2.1(VIN)
+5V_PCIE: C25.2 C29.2 L1.1 PCIE_5.0VEXT/5.0VIN.2 R47.1 U5.5(IN) U6.7(VIN)
+5V_USB2.0_OTG_PWR: C45.1 D7.A L10.1 USB2.0_OTG.VBUS
+5V_USB3.0_PWR: C36.1 D5.A L3.1 USB_MICRO_3.0-AB.1(VBUS)
+12V: +12V_PCIE.1(PP) C12.1 C13.1 C14.1 C15.1 C16.1 C20.1 D1.K(C) PCIE-X4.2(+12V) PCIE-X4.3(+12V) PCIE-X4.4(+12V) PCIE-X4.5(+12V) PCIE-X4.6(+12V) R48.2 ; supply symbol labelled +12V_PCIe
+15V: 5VEXT_E.1 C77.2 C78.2 D8.A D10.C FET9.3(D) FUSE2.1 FUSE2.2 PCIE_5.0VEXT/5.0VIN.1 PWR_JACK.+ R128.1 R132.2 R133.2 SOM204-EVB_PLATFORM.1(+5.0V_EXT) SOM204-EVB_PLATFORM.3(+5.0V_EXT) SOM204-EVB_PLATFORM.5(+5.0V_EXT) SOM204-EVB_PLATFORM.7(+5.0V_EXT) SOM204-EVB_PLATFORM.9(+5.0V_EXT) U11.2(VDD) U14.2(VCC) ; supply symbol labelled 5VEXT
+24V: C75.2 C76.2 LIPO_BAT.1 SOM204-EVB_PLATFORM.11(+3.7V_BAT) SOM204-EVB_PLATFORM.13(+3.7V_BAT) SOM204-EVB_PLATFORM.15(+3.7V_BAT) SOM204-EVB_PLATFORM.17(+3.7V_BAT) SOM204-EVB_PLATFORM.19(+3.7V_BAT) ; supply symbol labelled BAT
ADC: GPIO.10 SOM204-EVB_PLATFORM.77(ADC)
ANT: ANT2.ANT C70.2 L18.1 R139.2
AVDD1: C43.1 C64.2 CAM.4(AVDD) L14.1
CAM-HSYNC: RM3.3.2 SOM204-EVB_PLATFORM.170(CAM-HSYNC)
CAM-MCLK: RM3.2.2 SOM204-EVB_PLATFORM.168(CAM-MCLK)
CAM-PCLK: RM3.1.2 SOM204-EVB_PLATFORM.166(CAM-PCLK)
CAM-PWR-EN: R130.1 SOM204-EVB_PLATFORM.144(CAM-PWR-EN) VR1.3(CE) VR2.3(CE)
CAM-RST: CAM.6(RST) R109.1 SOM204-EVB_PLATFORM.148(CAM-RST)
CAM-SCL: CAM.5(SCL) FET8.2(S) R120.1
CAM-SDA: CAM.3(SDA) FET7.2(S) R119.1
CAM-STY: CAM.8(PWDN) R108.1 SOM204-EVB_PLATFORM.146(CAM-STY)
CAM-VSYNC: RM3.4.2 SOM204-EVB_PLATFORM.172(CAM-VSYNC)
CAM_1.8V [pwr]: C42.1 C61.2 CAM.10(DVDD) CAM_1.8V.1(PP) L8.2 VR1.5(VOUT)
CAM_2.8V: C41.1 C63.2 CAM.11(DOVDD) CAM_2.8V.1(PP) FET7.1(G) FET8.1(G) L14.2 R108.2 R109.2 R119.2 R120.2 VR2.5(VOUT)
CAM_D0: RM4.4.2 SOM204-EVB_PLATFORM.150(CAM_D0)
CAM_D1: RM4.3.2 SOM204-EVB_PLATFORM.152(CAM_D1)
CAM_D2: RM5.4.2 SOM204-EVB_PLATFORM.154(CAM_D2)
CAM_D3: RM5.3.2 SOM204-EVB_PLATFORM.156(CAM_D3)
CAM_D4: RM5.2.2 SOM204-EVB_PLATFORM.158(CAM_D4)
CAM_D5: RM5.1.2 SOM204-EVB_PLATFORM.160(CAM_D5)
CAM_D6: RM4.2.2 SOM204-EVB_PLATFORM.162(CAM_D6)
CAM_D7: RM4.1.2 SOM204-EVB_PLATFORM.164(CAM_D7)
CAN-CTRL: R2.2 SOM204-EVB_PLATFORM.29(CAN-CTRL)
CAN-RXD: R11.2 R13.1 SOM204-EVB_PLATFORM.33(CAN-RXD)
CAN-TXD: SOM204-EVB_PLATFORM.31(CAN-TXD) U2.1(TXD)
CANH: CAN.3 R12.2 U2.7(CANH)
CANL: CAN.2 CAN_T.2 U2.6(CANL)
CARD-DET#: R124.2 RM6.1.1 SOM204-EVB_PLATFORM.186(CARD-DET#)
CARD_SDIO-CLK: MICRO_SD.5(CLK/SCLK) SOM204-EVB_PLATFORM.180(CARD_SDIO-CLK)
CARD_SDIO-CMD: MICRO_SD.3(CMD/DI) R118.1 SOM204-EVB_PLATFORM.178(CARD_SDIO-CMD)
CARD_SDIO-D0: MICRO_SD.7(DAT0/DO) RM6.3.1 SOM204-EVB_PLATFORM.182(CARD_SDIO-D0)
CARD_SDIO-D1: MICRO_SD.8(DAT1/RES) RM6.2.1 SOM204-EVB_PLATFORM.184(CARD_SDIO-D1)
CARD_SDIO-D2: MICRO_SD.1(DAT2/RES) RM6.4.1 SOM204-EVB_PLATFORM.174(CARD_SDIO-D2)
CARD_SDIO-D3: MICRO_SD.2(CD/DAT3/CS) R116.1 SOM204-EVB_PLATFORM.176(CARD_SDIO-D3)
DAC: GPIO.11 SOM204-EVB_PLATFORM.75(DAC)
DBG_UART-RXD: D6.A R90.1 SOM204-EVB_PLATFORM.102(DBG_UART-RXD)
DBG_UART-TXD: DBG-UART.1 SOM204-EVB_PLATFORM.100(DBG_UART-TXD)
ETH1_LED1: R28.1 R31.1 R38.1 R39.1 SOM204-EVB_PLATFORM.50(ETH1_LED1)
ETH1_LED2: R36.1 R37.1 R49.1 R50.1 SOM204-EVB_PLATFORM.52(ETH1_LED2)
ETH1_MDI(0)+: LAN_GIGA(1000)_1.1 SOM204-EVB_PLATFORM.54(ETH1_MDI(0)+)
ETH1_MDI(0)-/TPRX-: LAN_GIGA(1000)_1.2 LAN_MEGA(100)_1.8(RD-) SOM204-EVB_PLATFORM.56(ETH1_MDI(0)-/TPRX-)
ETH1_MDI(1)+/TPRX+: LAN_GIGA(1000)_1.3 LAN_MEGA(100)_1.7(RD+) SOM204-EVB_PLATFORM.58(ETH1_MDI(1)+/TPRX+)
ETH1_MDI(1)-: LAN_GIGA(1000)_1.4 SOM204-EVB_PLATFORM.60(ETH1_MDI(1)-)
ETH1_MDI(2)+/PWFBOUT: C17.2 LAN_GIGA(1000)_1.7 LAN_MEGA(100)_1.3(COM) R40.1 SOM204-EVB_PLATFORM.62(ETH1_MDI(2)+/PWFBOUT)
ETH1_MDI(2)-/TPTX-: LAN_GIGA(1000)_1.8 LAN_MEGA(100)_1.2(TD-) SOM204-EVB_PLATFORM.64(ETH1_MDI(2)-/TPTX-)
ETH1_MDI(3)+/TPTX+: LAN_GIGA(1000)_1.9 LAN_MEGA(100)_1.1(TD+) SOM204-EVB_PLATFORM.66(ETH1_MDI(3)+/TPTX+)
ETH1_MDI(3)-: LAN_GIGA(1000)_1.10 SOM204-EVB_PLATFORM.68(ETH1_MDI(3)-)
ETH2_LED1: R60.1 R64.1 R71.1 R72.1 SOM204-EVB_PLATFORM.70(ETH2_LED1)
ETH2_LED2: R69.1 R70.1 R76.1 R77.1 SOM204-EVB_PLATFORM.72(ETH2_LED2)
ETH2_MDI(0)+: LAN_GIGA(1000)_2.1 SOM204-EVB_PLATFORM.74(ETH2_MDI(0)+)
ETH2_MDI(0)-/TPRX-: LAN_GIGA(1000)_2.2 LAN_MEGA(100)_2.8(RD-) SOM204-EVB_PLATFORM.76(ETH2_MDI(0)-/TPRX-)
ETH2_MDI(1)+/TPRX+: LAN_GIGA(1000)_2.3 LAN_MEGA(100)_2.7(RD+) SOM204-EVB_PLATFORM.78(ETH2_MDI(1)+/TPRX+)
ETH2_MDI(1)-: LAN_GIGA(1000)_2.4 SOM204-EVB_PLATFORM.80(ETH2_MDI(1)-)
ETH2_MDI(2)+/PWFBOUT: C33.2 LAN_GIGA(1000)_2.7 LAN_MEGA(100)_2.3(COM) R73.1 SOM204-EVB_PLATFORM.82(ETH2_MDI(2)+/PWFBOUT)
ETH2_MDI(2)-/TPTX-: LAN_GIGA(1000)_2.8 LAN_MEGA(100)_2.2(TD-) SOM204-EVB_PLATFORM.84(ETH2_MDI(2)-/TPTX-)
ETH2_MDI(3)+/TPTX+: LAN_GIGA(1000)_2.9 LAN_MEGA(100)_2.1(TD+) SOM204-EVB_PLATFORM.86(ETH2_MDI(3)+/TPTX+)
ETH2_MDI(3)-: LAN_GIGA(1000)_2.10 SOM204-EVB_PLATFORM.88(ETH2_MDI(3)-)
ETH_SHIELD: C24.1 C26.1 LAN_GIGA(1000)_1.SH1 LAN_GIGA(1000)_1.SH2 LAN_MEGA(100)_1.GND1 LAN_MEGA(100)_1.GND2
ETH_SHIELD1: C34.1 C35.1 LAN_GIGA(1000)_2.SH1 LAN_GIGA(1000)_2.SH2 LAN_MEGA(100)_2.GND1 LAN_MEGA(100)_2.GND2
GND [pwr]: 3.0V-BAT_RTC.- 5V_SATA_PWR.2 ANT1.GND ANT2.1(GND_1) ANT2.2(GND_2) C3.1 C4.1 C5.1 C9.2 C10.1 C11.1 C12.2 C13.2 C14.2 C15.2 C16.2 C17.1 C18.2 C19.2 C20.2 C21.2 C22.2 C23.2 C24.2 C25.1 C26.2 C29.1 C30.1 C31.1 C32.1 C33.1 C34.2 C35.2 C36.2 C37.2 C38.2 C39.1 C40.1 C41.2 C42.2 C43.2 C44.1 C45.2 C46.2 C47.2 C48.2 C49.1 C50.2 C51.2 C52.2 C53.1 C54.2 C55.2 C56.1 C57.1 C58.2 C60.1 C61.1 C62.1 C63.1 C64.1 C65.2 C66.2 C67.1 C68.1 C69.1 C70.1 C71.1 C72.1 C73.1 C74.1 C75.1 C76.1 C77.1 C78.1 CAM.1(GND) CAM.2(AGND) CAM.15(GND) CAM.23(NC) CAM.24(GND) CAN.1 D2.A D10.A DBG-UART.3 FET5.2(S) FET6.2(S) FET11.2(S) GND.1(PP) GND_.1(PP) GND_PIN1.P$1(PP) GPIO.2 GPIO.4 HDMI.2 HDMI.5 HDMI.8 HDMI.11 HDMI.17 HDMI.SH1 HDMI.SH2 HDMI.SH3 HDMI.SH4 IR1.2(GND) IR1.P$4 IR1.P$5 KEY-ADC.2 L7.1 L12.1 L17.1 LED1.C LED2.C LIPO_BAT.2 MICRO_SD.6(VSS) MICRO_SD.10(PACK1) MICRO_SD.11(PACK2) MICRO_SD.12(PACK3) MICRO_SD.13(PACK4) PCIE-X4.7(GND) PCIE-X4.8(GND) PCIE-X4.14(GND) PCIE-X4.23(GND) PCIE-X4.26(GND) PCIE-X4.29(GND) PCIE-X4.32(GND) PCIE-X4.35(GND) PCIE-X4.36(GND) PCIE-X4.39(GND) PCIE-X4.42(GND) PCIE-X4.44(GND) PCIE-X4.45(GND) PCIE-X4.47(GND) PCIE-X4.50(GND) PCIE-X4.52(GND) PCIE-X4.53(GND) PCIE-X4.55(GND) PCIE-X4.58(GND) PCIE-X4.61(GND) PCIE-X4.64(GND) PCIE-X4.MP1 PCIE-X4.MP2 PWR_BUT.P$2 PWR_JACK.- PWR_JACK.-- PWR_LED.C R1.2 R13.2 R21.2 R27.2 R35.1 R44.1 R51.1 R55.1 R56.2 R59.2 R61.2 R62.2 R63.2 R66.1 R74.1 R78.1 R99.2(1.2) R101.1 R102.1 R103.1 R111.2 R121.1 R122.1 R123.1 R125.1 R126.1 R130.2 R132.1 R134.1 R135.1 R136.1 R137.2 R138.1 RECOVERY.P$2 RESET.P$2 SATA.1(GND) SATA.4(GND) SATA.7(GND) SOM204-EVB_PLATFORM.2(GND) SOM204-EVB_PLATFORM.4(GND) SOM204-EVB_PLATFORM.6(GND) SOM204-EVB_PLATFORM.8(GND) SOM204-EVB_PLATFORM.10(GND) SOM204-EVB_PLATFORM.MH1(MH) SOM204-EVB_PLATFORM.MH2(MH) SOM204-EVB_PLATFORM.MP1(MP) SOM204-EVB_PLATFORM.MP2(MP) T1.2(E) T2.2(E) U1.3(GND) U1.8(GND) U2.2(VSS) U3.3(GND) U3.8(GND) U4.3(GND) U4.8(GND) U5.2(GND) U6.5(GND) U6.EP U6.EP1(EP) U7.2(GND) U8.2(GND) U9.1(GND) U9.20(GND) U9.31(GND) U9.33(GND) U9.36(GND) U9.41(GND) U10.2(GND) U11.3(GND) U12.2(GND) U13.2(GND) U14.3(GND) UBOOT.P$2 UEXT-1.2 UEXT-2.2 USB2.0_HOST.1.4 USB2.0_HOST.2.4 USB2.0_OTG.GND USB_MICRO_3.0-AB.5(GND) USB_MICRO_3.0-AB.8(GND) VGA_DB15-F.5 VGA_DB15-F.6 VGA_DB15-F.7 VGA_DB15-F.8 VGA_DB15-F.10 VR1.2(VSS) VR2.2(VSS) VR3.2(VSS)
GPIO0: GPIO.21 SOM204-EVB_PLATFORM.71(GPIO0)
GPIO1: GPIO.22 SOM204-EVB_PLATFORM.69(GPIO1)
GPIO2: GPIO.23 SOM204-EVB_PLATFORM.67(GPIO2)
GPIO3: GPIO.24 SOM204-EVB_PLATFORM.65(GPIO3)
GPIO4: GPIO.25 SOM204-EVB_PLATFORM.63(GPIO4)
GPIO5: GPIO.26 SOM204-EVB_PLATFORM.61(GPIO5)
GPIO6: GPIO.27 SOM204-EVB_PLATFORM.59(GPIO6)
GPIO7: GPIO.28 SOM204-EVB_PLATFORM.57(GPIO7)
GPIO8/LED1: GPIO.29 LED1_E.1 SOM204-EVB_PLATFORM.55(GPIO8/LED1)
GPIO9/LED2: GPIO.30 LED2_E.1 SOM204-EVB_PLATFORM.53(GPIO9/LED2)
GPIO10/MIC-DET#: GPIO.31 R98.1 SOM204-EVB_PLATFORM.51(GPIO10/MIC-DET)
GPIO11/HP-DET#: GPIO.32 R105.1 SOM204-EVB_PLATFORM.49(GPIO11/HP-DET)
GPIO12: GPIO.33 R29.2 R32.2
GPIO12/WL-WAKE-AP: R29.1 R112.1 SOM204-EVB_PLATFORM.47(GPIO12/WL-WAKE-AP)
GPIO13: GPIO.34 R30.2 R33.2
GPIO13/BT-WAKE-AP: R30.1 R107.1 SOM204-EVB_PLATFORM.45(GPIO13/BT-WAKE-AP)
HDMI-CEC: FET2.2(S) R10.1 SOM204-EVB_PLATFORM.42(HDMI-CEC) U4.1(IN1) U4.10(OUT1)
HDMI-HPD: R18.2 R21.1 SOM204-EVB_PLATFORM.48(HDMI-HPD) U4.5(IN4) U4.6(OUT4)
HDMI-SCL: FET4.2(S) R20.2 SOM204-EVB_PLATFORM.44(HDMI-SCL)
HDMI-SDA: FET3.2(S) R19.2 SOM204-EVB_PLATFORM.46(HDMI-SDA)
HDMI-TX0N: HDMI.9 R9.1 SOM204-EVB_PLATFORM.36(HDMI-TX0N) U3.2(IN2) U3.9(OUT2)
HDMI-TX0P: HDMI.7 R9.2 SOM204-EVB_PLATFORM.34(HDMI-TX0P) U3.1(IN1) U3.10(OUT1)
HDMI-TX1N: HDMI.6 R7.2 SOM204-EVB_PLATFORM.32(HDMI-TX1N) U1.5(IN4) U1.6(OUT4)
HDMI-TX1P: HDMI.4 R7.1 SOM204-EVB_PLATFORM.30(HDMI-TX1P) U1.4(IN3) U1.7(OUT3)
HDMI-TX2N: HDMI.3 R3.1 SOM204-EVB_PLATFORM.28(HDMI-TX2N) U1.2(IN2) U1.9(OUT2)
HDMI-TX2P: HDMI.1 R3.2 SOM204-EVB_PLATFORM.26(HDMI-TX2P) U1.1(IN1) U1.10(OUT1)
HDMI-TXCN: HDMI.12 R15.2 SOM204-EVB_PLATFORM.40(HDMI-TXCN) U3.5(IN4) U3.6(OUT4)
HDMI-TXCP: HDMI.10 R15.1 SOM204-EVB_PLATFORM.38(HDMI-TXCP) U3.4(IN3) U3.7(OUT3)
HDMI_5V_SOURCE1: FUSE1.2 HDMI.18
HDMI_SCL: FET4.3(D) HDMI.15 R16.1 U4.2(IN2) U4.9(OUT2)
HDMI_SDA: FET3.3(D) HDMI.16 R17.1 U4.4(IN3) U4.7(OUT3)
HPCOM/LINEOUTCOM: L6.1 SOM204-EVB_PLATFORM.165(HPCOM/LINEOUTCOM)
HPOUTL/LINEOUTL: L5.1 SOM204-EVB_PLATFORM.167(HPOUTL/LINEOUTL)
HPOUTR/LINEOUTR: L4.1 SOM204-EVB_PLATFORM.169(HPOUTR/LINEOUTR)
HSIC-DAT: GPIO.14 SOM204-EVB_PLATFORM.179(HSIC-DAT)
HSIC-STR: GPIO.13 SOM204-EVB_PLATFORM.181(HSIC-STR)
IPSOUT: C72.2 GPIO.5 L15.1 SOM204-EVB_PLATFORM.12(IPSOUT) SOM204-EVB_PLATFORM.14(IPSOUT) SOM204-EVB_PLATFORM.16(IPSOUT) SOM204-EVB_PLATFORM.18(IPSOUT) SOM204-EVB_PLATFORM.20(IPSOUT) U13.5(IN)
IR_RX: R117.2 SOM204-EVB_PLATFORM.142(IR_RX)
IR_TX: R106.1 SOM204-EVB_PLATFORM.140(IR_TX)
KEY-ADC: GPIO.9 KEY-ADC.1 SOM204-EVB_PLATFORM.79(KEY-ADC)
KEY-PWRON: GPIO.8 R22.2 SOM204-EVB_PLATFORM.85(KEY-PWRON)
KEY-RECOVERY: R24.2 SOM204-EVB_PLATFORM.83(KEY-RECOVERY)
KEY-RESET: GPIO.7 R25.2 SOM204-EVB_PLATFORM.87(KEY-RESET)
KEY-UBOOT: R23.2 SOM204-EVB_PLATFORM.81(KEY-UBOOT)
MIC_GND: MIC/LINEIN.5 R99.1(1.1)
MICINL/LINEINL: MIC/LINEIN.2 R127.1 SOM204-EVB_PLATFORM.171(MICINL/LINEINL)
MICINR/LINEINR: MIC/LINEIN.3 SOM204-EVB_PLATFORM.173(MICINR/LINEINR)
N$1: R8.2 T1.3(C)
N$2: R102.2 U7.3(ISET)
N$3: C37.1 C39.2 L3.2 R94.2 U7.1(OUT)
N$4: C58.1 U11.5(CT)
N$5: ANT1.ANT R139.1
N$6: LAN_GIGA(1000)_2.14 R59.1 R64.2
N$7: LAN_GIGA(1000)_2.11 R77.2 R87.2
N$8: R1.1 R2.1 U2.8(STBY)
N$9: LAN_MEGA(100)_1.6(NC) R40.2
N$10: LAN_GIGA(1000)_1.13 R26.2 R28.2
N$11: LAN_GIGA(1000)_1.14 R27.1 R31.2
N$12: R23.1 UBOOT.P$1
N$13: R24.1 RECOVERY.P$1
N$14: PWR_BUT.P$1 R22.1
N$16: MICRO_SD.9(CP_E) R124.1
N$17: IR_LED1.K(C) T2.3(C)
N$18: C10.2 LAN_GIGA(1000)_1.5
N$19: L12.2 USB2.0_OTG.GND1 USB2.0_OTG.GND2 USB2.0_OTG.GND3 USB2.0_OTG.GND4
N$20: C11.2 LAN_GIGA(1000)_1.6
N$21: R122.2 U8.3(ISET)
N$22: LAN_GIGA(1000)_1.12 R49.2 R51.2
N$23: C46.1 C47.1 L10.2 R115.2 U8.1(OUT)
N$24: FET5.1(G) R96.2
N$25: LAN_GIGA(1000)_1.11 R50.2 R53.2
N$26: D3.C UEXT-1.4
N$27: D4.C UEXT-2.4
N$28: C31.2 LAN_GIGA(1000)_2.5
N$29: C32.2 LAN_GIGA(1000)_2.6
N$30: LAN_GIGA(1000)_2.12 R76.2 R78.2
N$31: LAN_GIGA(1000)_2.13 R58.2 R60.2
N$32: LAN_MEGA(100)_2.AG R65.2 R69.2
N$33: LAN_MEGA(100)_2.KY R72.2 R74.2
N$34: CAM.13(MCLK) RM3.2.1
N$35: CAM.17(PCLK) RM3.1.1
N$36: CAM.7(VSYNC) RM3.4.1
N$37: CAM.9(HSYNC) RM3.3.1
N$38: CAM.12(D9) RM4.1.1
N$39: CAM.14(D8) RM4.2.1
N$40: CAM.16(D7) RM5.1.1
N$41: CAM.18(D6) RM5.2.1
N$42: CAM.20(D5) RM5.3.1
N$43: CAM.22(D4) RM5.4.1
N$44: CAM.21(D3) RM4.3.1
N$45: CAM.19(D2) RM4.4.1
N$46: LAN_MEGA(100)_2.6(NC) R73.2
N$47: LAN_MEGA(100)_1.AG R34.2 R36.2
N$48: LAN_MEGA(100)_2.AY R71.2 R75.2
N$49: IR_LED1.A R100.1
N$50: C59.1 U9.2(WIFI/BT_ANT)
N$51: R106.2 R111.1 T2.1(B)
N$52: D1.A L1.2 U5.1(LX)
N$54: C6.1 FET1.1(G) R6.2 R8.1
N$55: 5V_SATA_E.1 5V_SATA_PWR.1 C3.2 C4.2 C5.2 FET1.3(D)
N$56: C71.2 D9.K(C) FET10.3(D) R131.2
N$57: R48.1 R56.1 U5.3(FB)
N$59: C59.2 C69.2 L18.2
N$60: L7.2 USB_MICRO_3.0-AB.SH1(GND1) USB_MICRO_3.0-AB.SH2(GND2) USB_MICRO_3.0-AB.SH3(GND3) USB_MICRO_3.0-AB.SH4(GND4) USB_MICRO_3.0-AB.SH5(GND5) USB_MICRO_3.0-AB.SH6(GND6)
N$61: R112.2 R113.2 U9.13(WL_HOST_WAKE)
N$62: R107.2 R110.2 U9.7(BT_HOST_WAKE)
N$63: PCIE-X4.10(SMCLK) R43.1
N$64: PCIE-X4.12(SMDAT) R45.1
N$66: R61.1 U6.6(FREQ)
N$67: MIC/LINEIN.1 R95.2 R98.2
N$68: C27.1 U6.8(BST)
N$70: C28.1 U6.3(COMP)
N$71: C28.2 R62.1
N$72: R57.1 R63.1 U6.4(FB)
N$73: HEADPHONES/LINEOUT.1 R104.2 R105.2 R127.2
N$74: R25.1 RESET.P$1
N$75: FET6.1(G) R97.2
N$76: FET9.1(G) FET11.3(D) R129.2
N$77: R14.1 U2.5(VIO)
N$78: R11.1 U2.4(RXD)
N$80: LAN_MEGA(100)_2.KG R66.2 R70.2
N$81: LAN_MEGA(100)_1.KG R35.2 R37.2
N$82: LAN_MEGA(100)_1.KY R39.2 R44.2
N$83: LAN_MEGA(100)_1.AY R38.2 R46.2
N$84: U9.24(SUSCLK_IN/GPIO6) WIFI(BT)_GPIO1.1(PP)
N$85: IR1.1(VOUT) R117.1
N$86: LED1.A R4.2
N$87: LED2.A R5.2
N$88: LED1_E.2 R4.1
N$89: LED2_E.2 R5.1
N$91: HDMI.19 R18.1
N$97: HEADPHONES/LINEOUT.5 L6.2
N$98: HEADPHONES/LINEOUT.2 L5.2
N$99: HEADPHONES/LINEOUT.3 L4.2
N$101: R125.2 U10.3(ISET)
N$106: C1.2 SATA.2(A+)
N$107: FET2.3(D) HDMI.13
N$110: D6.C DBG-UART.2
N$111: C54.1 L13.2 USB2.0_HOST.1.1
N$112: C2.2 SATA.3(A-)
N$113: C7.2 SATA.5(B-)
N$114: C8.2 SATA.6(B+)
N$123: D9.A L15.2 U13.1(LX)
N$126: R131.1 R137.1 U13.3(FB)
N$129: PWR_LED.A R128.2
N$137: R134.2 U12.3(ISET)
N$192: C55.1 C56.2 L13.1 U10.1(OUT)
N$193: L17.2 USB2.0_HOST.GND1 USB2.0_HOST.GND2 USB2.0_HOST.GND3 USB2.0_HOST.GND4
N$194: C65.1 L16.2 USB2.0_HOST.2.1
N$195: C66.1 C67.2 L16.1 U12.1(OUT)
N$566: CAN_T.1 R12.1
PCIE-PWRE: R47.2 R55.2 R67.2 U5.4(EN) U6.2(EN)
PCIE_CLK_REF+: PCIE-X4.25(REFCLK+) SOM204-EVB_PLATFORM.131(PCIE_CLK_REF+)
PCIE_CLK_REF-: PCIE-X4.27(REFCLK-) SOM204-EVB_PLATFORM.129(PCIE_CLK_REF-)
PCIE_PRSNT1#(X1): PCIE-X4.1(PRSNT1#) R41.1 R42.2(1.2) R68.2
PCIE_PRSNT2#(X1): PCIE-X4.34(PRSNT2#) R41.2
PCIE_PRSNT2#(X4): PCIE-X4.62(PRSNT2#) R42.1(1.1)
PCIE_PRSNT#: GPIO.17 R68.1 SOM204-EVB_PLATFORM.93(PCIE_PRSNT#)
PCIE_PWREN: GPIO.18 R67.1 SOM204-EVB_PLATFORM.95(PCIE_PWREN)
PCIE_RESET: GPIO.19 PCIE-X4.21(PERST#) SOM204-EVB_PLATFORM.89(PCIE_RESET)
PCIE_RX0+: PCIE-X4.31(PERP0) SOM204-EVB_PLATFORM.111(PCIE_RX0+)
PCIE_RX0-: PCIE-X4.33(PERN0) SOM204-EVB_PLATFORM.109(PCIE_RX0-)
PCIE_RX1+: PCIE-X4.41(PERP1) SOM204-EVB_PLATFORM.107(PCIE_RX1+)
PCIE_RX1-: PCIE-X4.43(PERN1) SOM204-EVB_PLATFORM.105(PCIE_RX1-)
PCIE_RX2+: PCIE-X4.49(PERP2) SOM204-EVB_PLATFORM.103(PCIE_RX2+)
PCIE_RX2-: PCIE-X4.51(PERN2) SOM204-EVB_PLATFORM.101(PCIE_RX2-)
PCIE_RX3+: PCIE-X4.57(PERP3) SOM204-EVB_PLATFORM.99(PCIE_RX3+)
PCIE_RX3-: PCIE-X4.59(PERN3) SOM204-EVB_PLATFORM.97(PCIE_RX3-)
PCIE_TX0+: PCIE-X4.28(PETP0) SOM204-EVB_PLATFORM.127(PCIE_TX0+)
PCIE_TX0-: PCIE-X4.30(PETN0) SOM204-EVB_PLATFORM.125(PCIE_TX0-)
PCIE_TX1+: PCIE-X4.38(PETP1) SOM204-EVB_PLATFORM.123(PCIE_TX1+)
PCIE_TX1-: PCIE-X4.40(PETN1) SOM204-EVB_PLATFORM.121(PCIE_TX1-)
PCIE_TX2+: PCIE-X4.46(PETP2) SOM204-EVB_PLATFORM.119(PCIE_TX2+)
PCIE_TX2-: PCIE-X4.48(PETN2) SOM204-EVB_PLATFORM.117(PCIE_TX2-)
PCIE_TX3+: PCIE-X4.54(PETP3) SOM204-EVB_PLATFORM.115(PCIE_TX3+)
PCIE_TX3-: PCIE-X4.56(PETN3) SOM204-EVB_PLATFORM.113(PCIE_TX3-)
PCIE_WAKE#: GPIO.20 PCIE-X4.22(WAKE#) R54.1 SOM204-EVB_PLATFORM.91(PCIE_WAKE#)
PWM: GPIO.12 SOM204-EVB_PLATFORM.73(PWM)
RST_CTRL: FET10.1(G) FET11.1(G) R133.1 R136.2 U11.1(#RST) U14.1(RESET)
SATA-PWR-EN: SOM204-EVB_PLATFORM.35(SATA-PWR-EN) T1.1(B)
SATA-RXM: C7.1 SOM204-EVB_PLATFORM.41(SATA-RXM)
SATA-RXP: C8.1 SOM204-EVB_PLATFORM.43(SATA-RXP)
SATA-TXM: C2.1 SOM204-EVB_PLATFORM.39(SATA-TXM)
SATA-TXP: C1.1 SOM204-EVB_PLATFORM.37(SATA-TXP)
SD_VCC: C44.2 L11.2 MICRO_SD.4(VDD)
SPDIF-DI: GPIO.15 SOM204-EVB_PLATFORM.177(SPDIF-DI)
SPDIF-DO: GPIO.16 SOM204-EVB_PLATFORM.175(SPDIF-DO)
SW: C27.2 D2.K(C) L2.1 U6.1(SW)
UEXT1_#CS: R82.1 SOM204-EVB_PLATFORM.149(UEXT1_#CS) UEXT-1.10
UEXT1_CLK: SOM204-EVB_PLATFORM.151(UEXT1_CLK) UEXT-1.9
UEXT1_MISO: SOM204-EVB_PLATFORM.155(UEXT1_MISO) UEXT-1.7
UEXT1_MOSI: SOM204-EVB_PLATFORM.153(UEXT1_MOSI) UEXT-1.8
UEXT1_RXD: D3.A R80.1 SOM204-EVB_PLATFORM.161(UEXT1_RXD)
UEXT1_SCL/CAM-SCL: FET8.3(D) R79.1 SOM204-EVB_PLATFORM.159(UEXT1_SCL/CAM-SCL) UEXT-1.5
UEXT1_SDA/CAM-SDA: FET7.3(D) R81.1 SOM204-EVB_PLATFORM.157(UEXT1_SDA/CAM-SDA) UEXT-1.6
UEXT1_TXD: SOM204-EVB_PLATFORM.163(UEXT1_TXD) UEXT-1.3
UEXT2_#CS: R86.1 SOM204-EVB_PLATFORM.133(UEXT2_#CS) UEXT-2.10
UEXT2_CLK: SOM204-EVB_PLATFORM.135(UEXT2_CLK) UEXT-2.9
UEXT2_MISO: SOM204-EVB_PLATFORM.139(UEXT2_MISO) UEXT-2.7
UEXT2_MOSI: SOM204-EVB_PLATFORM.137(UEXT2_MOSI) UEXT-2.8
UEXT2_RXD: D4.A R84.1 SOM204-EVB_PLATFORM.145(UEXT2_RXD)
UEXT2_SCL/PCIE-SMCLK: R43.2 R83.1 SOM204-EVB_PLATFORM.143(UEXT2_SCL/PCIE-SMCLK) UEXT-2.5
UEXT2_SDA/PCIE-SMDAT: R45.2 R85.1 SOM204-EVB_PLATFORM.141(UEXT2_SDA/PCIE-SMDAT) UEXT-2.6
UEXT2_TXD: SOM204-EVB_PLATFORM.147(UEXT2_TXD) UEXT-2.3
USB2.0_HOST1-DM: SOM204-EVB_PLATFORM.193(USB2.0_HOST1-DM) USB2.0_HOST.1.2
USB2.0_HOST1-DP: SOM204-EVB_PLATFORM.195(USB2.0_HOST1-DP) USB2.0_HOST.1.3
USB2.0_HOST1-DRV [pwr]: R126.2 SOM204-EVB_PLATFORM.197(USB2.0_HOST1-DRV) U10.4(EN)
USB2.0_HOST2-DM: SOM204-EVB_PLATFORM.199(USB2.0_HOST2-DM) USB2.0_HOST.2.2
USB2.0_HOST2-DP: SOM204-EVB_PLATFORM.201(USB2.0_HOST2-DP) USB2.0_HOST.2.3
USB2.0_HOST2-DRV [pwr]: R135.2 SOM204-EVB_PLATFORM.203(USB2.0_HOST2-DRV) U12.4(EN)
USB2.0_OTG-DM: SOM204-EVB_PLATFORM.185(USB2.0_OTG-DM) USB2.0_OTG.D-
USB2.0_OTG-DP: SOM204-EVB_PLATFORM.187(USB2.0_OTG-DP) USB2.0_OTG.D+
USB2.0_OTG-DRV: R123.2 SOM204-EVB_PLATFORM.191(USB2.0_OTG-DRV) U8.4(EN)
USB2.0_OTG-IDDET: R114.1 SOM204-EVB_PLATFORM.189(USB2.0_OTG-IDDET) USB2.0_OTG.ID
USB2.0_OTG-VBUSDET: C48.1 R115.1 R121.2 SOM204-EVB_PLATFORM.183(USB2.0_OTG-VBUSDET)
USB3.0_AB-DM: SOM204-EVB_PLATFORM.200(USB3.0_AB-DM) USB_MICRO_3.0-AB.2(D-)
USB3.0_AB-DP: SOM204-EVB_PLATFORM.198(USB3.0_AB-DP) USB_MICRO_3.0-AB.3(D+)
USB3.0_AB-DRV: R103.2 SOM204-EVB_PLATFORM.204(USB3.0_AB-DRV) U7.4(EN)
USB3.0_AB-IDDET: R93.1 SOM204-EVB_PLATFORM.196(USB3.0_AB-IDDET) USB_MICRO_3.0-AB.4(ID)
USB3.0_AB-SSRXN: SOM204-EVB_PLATFORM.190(USB3.0_AB-SSRXN) USB_MICRO_3.0-AB.9(SSRX-)
USB3.0_AB-SSRXP: SOM204-EVB_PLATFORM.188(USB3.0_AB-SSRXP) USB_MICRO_3.0-AB.10(SSRX+)
USB3.0_AB-SSTXN: SOM204-EVB_PLATFORM.194(USB3.0_AB-SSTXN) USB_MICRO_3.0-AB.6(SSTX-)
USB3.0_AB-SSTXP: SOM204-EVB_PLATFORM.192(USB3.0_AB-SSTXP) USB_MICRO_3.0-AB.7(SSTX+)
USB3.0_AB-VBUSDET: C38.1 R94.1 R101.2 SOM204-EVB_PLATFORM.202(USB3.0_AB-VBUSDET)
VCC [pwr]: C50.1 C51.1 C53.2 C73.2 CAN_3.3V/5.0V.3 FET2.1(G) FET3.1(G) FET4.1(G) GPIO.3 IR1.3(VCC) L9.1 L11.1 R10.2 R14.2 R19.1 R20.1 R26.1 R34.1 R46.1 R53.1 R58.1 R65.1 R75.1 R79.2 R80.2 R81.2 R82.2 R83.2 R84.2 R85.2 R86.2 R87.1 R90.2 R93.2 R95.1 R100.2 R104.1 R114.2 R116.2 R118.2 RM1.1.2 RM1.2.2 RM1.3.2 RM1.4.2 RM2.1.2 RM2.2.2 RM2.3.2 RM2.4.2 RM6.1.2 RM6.2.2 RM6.3.2 RM6.4.2 SOM204-EVB_PLATFORM.22(+3.3V_SOM) SOM204-EVB_PLATFORM.24(+3.3V_SOM) U9.9(VDD33) UEXT-1.1 UEXT-2.1 VR3.1(VIN) VR3.3(CE) ; supply symbol labelled 3.3V
VDD_CAN [pwr]: C9.1 CAN_3.3V/5.0V.2 U2.3(VDD)
VGA-B: SOM204-EVB_PLATFORM.94(VGA-B) VGA_DB15-F.3
VGA-G: SOM204-EVB_PLATFORM.92(VGA-G) VGA_DB15-F.2
VGA-HSYNC: R92.1 R97.1 SOM204-EVB_PLATFORM.96(VGA-HSYNC)
VGA-R: SOM204-EVB_PLATFORM.90(VGA-R) VGA_DB15-F.1
VGA-VSYNC: R91.1 R96.1 SOM204-EVB_PLATFORM.98(VGA-VSYNC)
VGA_HSYNC: FET6.3(D) R88.2 R92.2 VGA_DB15-F.13
VGA_VSYNC: FET5.3(D) R89.2 R91.2 VGA_DB15-F.14
VPP: +3.3V_PCIE.1(PP) C18.1 C19.1 C21.1 C23.1 C30.2 L2.2 PCIE-X4.16(+3.3V) PCIE-X4.17(+3.3V) PCIE-X4.19(+3.3V) R52.2(1.2) R54.2 R57.2 ; supply symbol labelled +3.3V_PCIe
WIFI(BT)_I2S_BCLK/PCM_CLK: SOM204-EVB_PLATFORM.118(WIFI(BT)_I2S_BCLK/PCM_CLK) U9.26(PCM_CLK)
WIFI(BT)_I2S_DI/PCM_DIN: SOM204-EVB_PLATFORM.130(WIFI(BT)_I2S_DI/PCM_DIN) U9.25(PCM_DOUT)
WIFI(BT)_I2S_DO0/PCM_DOUT: SOM204-EVB_PLATFORM.122(WIFI(BT)_I2S_DO0/PCM_DOUT) U9.27(PCM_DIN)
WIFI(BT)_I2S_DO1/AP-WAKE-BT: SOM204-EVB_PLATFORM.124(WIFI(BT)_I2S_DO1/AP-WAKE-BT) U9.6(BT_WAKE)
WIFI(BT)_I2S_DO2/BT-WAKE-AP: R33.1 R110.1 SOM204-EVB_PLATFORM.126(WIFI(BT)_I2S_DO2/BT-WAKE-AP)
WIFI(BT)_I2S_DO3/BT_DIS#: RM2.1.1 SOM204-EVB_PLATFORM.128(WIFI(BT)_I2S_DO3/BT_DIS#) U9.34(BT_DIS#)
WIFI(BT)_I2S_LRCK/PCM_SYNC: SOM204-EVB_PLATFORM.120(WIFI(BT)_I2S_LRCK/PCM_SYNC) U9.28(PCM_SYNC)
WIFI(BT)_I2S_MCLK/WL-WAKE-AP: R32.1 R113.1 SOM204-EVB_PLATFORM.116(WIFI(BT)_I2S_MCLK/WL-WAKE-AP)
WIFI(BT)_SDIO-CLK: SOM204-EVB_PLATFORM.110(WIFI(BT)_SDIO-CLK) U9.17(SD_CLK)
WIFI(BT)_SDIO-CMD: RM1.1.1 SOM204-EVB_PLATFORM.108(WIFI(BT)_SDIO-CMD) U9.16(SD_CMD)
WIFI(BT)_SDIO-D0: RM2.4.1 SOM204-EVB_PLATFORM.112(WIFI(BT)_SDIO-D0) U9.18(SD_D0)
WIFI(BT)_SDIO-D1: RM2.3.1 SOM204-EVB_PLATFORM.114(WIFI(BT)_SDIO-D1) U9.19(SD_D1)
WIFI(BT)_SDIO-D2: RM1.3.1 SOM204-EVB_PLATFORM.104(WIFI(BT)_SDIO-D2) U9.14(SD_D2)
WIFI(BT)_SDIO-D3: RM1.2.1 SOM204-EVB_PLATFORM.106(WIFI(BT)_SDIO-D3) U9.15(SD_D3)
WIFI(BT)_UART-CTS/WL_DIS#: RM1.4.1 SOM204-EVB_PLATFORM.138(WIFI(BT)_UART-CTS/WL_DIS#) U9.12(WL_DSI#/GPIO9)
WIFI(BT)_UART-RTS: SOM204-EVB_PLATFORM.136(WIFI(BT)_UART-RTS) U9.44(UART_CTS)
WIFI(BT)_UART-RXD: SOM204-EVB_PLATFORM.134(WIFI(BT)_UART-RXD) U9.42(UART_OUT)
WIFI(BT)_UART-TXD: RM2.2.1 SOM204-EVB_PLATFORM.132(WIFI(BT)_UART-TXD) U9.43(UART_IN)
WIFI(BT)_VDDIO [pwr]: C52.1 C74.2 L8.1 L9.2 U9.22(VDD_IO) VR3.5(VOUT)
Unconnected: HDMI.14 HEADPHONES/LINEOUT.4 MIC/LINEIN.4 PCIE-X4.9(TCK) PCIE-X4.11(TDI) PCIE-X4.13(TDO) PCIE-X4.15(TMS) PCIE-X4.18(TRST#) PCIE-X4.24(RESERV) PCIE-X4.37(RESERV) PCIE-X4.60(RESERV) PCIE-X4.63(RESERV) U5.6(NC) U9.3(NC) U9.4(NC) U9.5(NC) U9.8(NC) U9.10(NC) U9.11(NC) U9.21(NC) U9.23(NC) U9.29(NC) U9.30(NC) U9.32(NC) U9.35(NC) U9.37(NC) U9.38(NC) U9.39(NC) U9.40(NC) U13.6(NC) VGA_DB15-F.4 VGA_DB15-F.9 VGA_DB15-F.11 VGA_DB15-F.12 VGA_DB15-F.15

## Buses
HTX0P,HTX0N,HTX1P,HTX1N,HTX2P,HTX2N,HTXCP,HTXCN,HSCL,HSDA,HHPD,HCEC
USB0-DM,USB0-DP,USB0-SSTXN,USB0-SSTXP,USB0-SSRXN,USB0-SSRXP,USB1-DM,USB1-DP,USB2-DM,USB2-DP
SATA-TXP,SATA-TXM,SATA-RXM,SATA-RXP,SATA-PWR-EN
MICROPHONE,HPCOMFB,HPOUTL,HPCOM,HPOUTR
SD0-D[0..3],SD0-CMD,SD0-CLK,SD0-DET#
CSI0_MCLK,CSI0_PCLK,CSI0_VSYNC,CSI0_HSYNC,CSI0_D[0..7],CAM-SDA,CAM-SCK,CAM-PWR-EN,CAM-RST,CAM-STY
MDI(0)+,MDI(0)-/TPRX-,MDI(1)+/TPRX+,MDI(1)-,MDI(2)+/PWFBOUT,MDI(2)-/TPTX-,MDI(3)+/TPTX+,MDI(3)-,LED1/PHY_AD1,ETH2_LED0/PHY_AD0
UEXT-TXD,UEXT-RXD,UEXT-SCL,UEXT-SDA,UEXT-MISO,UEXT-MOSI,UEXT-CLK,UEXT-CS
CAN1_TX,CAN1_RX,CAN_CTRL
B$1
B$2
B$3
MDI(0)+,MDI(0)-/TPRX-,MDI(1)+/TPRX+,MDI(1)-,MDI(2)+/PWFBOUT,MDI(2)-/TPTX-,MDI(3)+/TPTX+,MDI(3)-,LED1/PHY_AD1,ETH1_LED0/PHY_AD0
B$4
DBG_UART-TXD,DBG_UART-RXD
IR_TX,IR_RX
B$5

## Notes on the sheet
- CAN DRIVER | SATA | HDMI
- User
- +
- -
- LEDs
- Options were added for MCP2562-E/SN and SN65HVD230D usage! Initially was used: MCP2551-I/SN(SO8)
- GPIOs
- Buttons
- MEGABIT/GIGABIT ETHERNET TRANSCEIVER 1
- Default: MEGABIT ETHERNET
- For example: LAN8710A-EZC-TR(QFN-32)
- Power Rating for PCIe x4 Cards:
- -> 375mA (max) at +3.3Vaux
- -> 3.0A (max) at +3.3V (9.9W) | PCIe x4
- Hot-Plug presence detect
- -> 2.1A (max) at +12V (25W)
- 2-24VDC | Rc
- Rd
- Vout=0.6x(1+Rc/Rd)
- Hot-Plug presence detect
- MEGABIT/GIGABIT ETHERNET TRANSCEIVER 2
- 4.5-28VDC
- Default: GIGABIT ETHERNET | For example: KSZ9031RNXCC-TR(QFN48)
- Ra
- Rb
- Vout=0.8x(1+Ra/Rb)
- Hot-Plug presence detect
- PCIe x4 High Frequency
- Note: PRSNT1# Must be connected | Decoupling Requirements:
- to the farthest PRSNT2# pin!!! | VCC_12V: 1x 22µF, 2x 100nF
- Note: Place the AC coupling capacitors close to PCIe Transmitter on the SOM!!!
- https://en.wikipedia.org/wiki/PCI_Express | VCC_3V3: 2x 22µF, 4x 100nF
- Use 100nF/16V/10%/X7R, shape 0402 discrete capacitors
- UEXTs
- Debug UART | VGA
- USB3.0-AB
- Audio | IR_Tx/Rx | WiFi/BT | RTC
- Battery
- RTL8723BS(ComboModule)
- Option for handsfree usage!
- Rs
- Iset = 6800/Rs | Camera
- Iset = 1000mA
- USB2.0-OTG
- MicroSD
- Rs
- Iset = 6800/Rs
- Iset = 1000mA
- MCP120T-475 holds RESET for 350ms(typical) | When BD5245's Vdd=5.0V, CT=100nF,
- then: tPLH approx. 625ms
- Power Supply
- 2-8VDC | 2-8VDC
- USB2.0-HOSTs | Rs
- Iset = 6800/Rs
- Iset = 1744mA
- Option!!!
- 5VDC_Only!!!
- Support for VDD_IO=1.8V
- Re | 2-24VDC
- 2-8VDC
- +
- Rs | -
- Iset = 6800/Rs | Rf
- LI-ION_BATTERY
- Iset = 1744mA | Fiducials
- 4.2V
- Vout=0.6x(1+Re/Rf)

## Power pins joined to a net without a drawn wire
GND: VGA_DB15-F.GND1 VGA_DB15-F.GND2

## Library data of the parts
3.0V-BAT_RTC = DOUBLE-SIDE:B: LI BATTERY Varta
5V_SATA_E 5VEXT_E CAN_T LED1_E LED2_E = jumper:SJ: SMD solder JUMPER
5V_SATA_PWR LIPO_BAT = Penko:CON2
+3.3V_PCIE +5V +12V_PCIE CAM_1.8V CAM_2.8V GND GND_ GND_PIN1 WIFI(BT)_GPIO1 = gogo:TESTPAD: drill 40mils, diameter 70mils
ANT1 = OLIMEX_DISCRET:ANTENNA_GND
ANT2 = OLIMEX_CONNECTORS:RF_CON
C1-C78 = rcl:C-EU: CAPACITOR, European symbol
CAM = OLIMEX_CONNECTORS:CAMERA_2M-GT2005
CAN DBG-UART = Penko:CON3
CAN_3.3V/5.0V PCIE_5.0VEXT/5.0VIN = jumper:SJ2W: SMD solder JUMPER
D1-D9 = gogo:SCHOTKKY7.62SS
D10 = OLIMEX_DISCRET:SMBJ16A
FET1 FET9 FET10 = Penko:P-MOS+DIOD
FET2-FET8 FET11 = Penko:N-MOS+DIOD
FID1-FID6 = SparkFunEagle-6-6-07:FIDUCIAL: Fiducial Alignment Points Various fiducial points for machine vision alignment.
FUSE1 FUSE2 = gogo:FUSE
GPIO = con-harting-ml:ML34: HARTING
HDMI = OLIMEX_CONNECTORS:HDMI-MC34931
HEADPHONES/LINEOUT MIC/LINEIN = gogo:AUDIO_JACK_5PIN
IR1 = OLIMEX_DISCRET:RPM7236
IR_LED1 LED1 LED2 PWR_LED = DOUBLE-SIDE:LED
KEY-ADC = jumper:JP1E: JUMPER
L1 L2 L15 = OLIMEX_DISCRET:L
L3-L14 L16-L18 = rcl:L-US: INDUCTOR, American symbol
LAN_GIGA(1000)_1 LAN_GIGA(1000)_2 = OLIMEX_CONNECTORS:TM211Q01FM22_SH
LAN_MEGA(100)_1 LAN_MEGA(100)_2 = OLIMEX_CONNECTORS:RJLBC-060TC1_GND
MICRO_SD = OLIMEX_CONNECTORS:MICRO_SD/MMC_CP_NEW
PCIE-X4 = OLIMEX_CONNECTORS:PCIE-X4_CONNECTOR
PWR_BUT RECOVERY RESET UBOOT = gogo:SW-TAKT
PWR_JACK = gogo:PWR-JAK
R1-R41 R43-R51 R53-R98 R100-R139 = rcl:R-EU_: RESISTOR, European symbol
R42 R52 R99 = OLIMEX_DISCRET:R_0R
RM1-RM6 = OLIMEX_DISCRET:R_MATRIX_4E
SATA = OLIMEX_CONNECTORS:SATA-PWA-07
SOM204-EVB_PLATFORM = OLIMEX_CASES:SOM204-EVB
T1 = OLIMEX_DISCRET:DIGITAL_TRANSISTORS-NPN: DTC114YKA Digital Transistor - NPN
T2 = semicon-smd-ipc:NPN-TRANSISTOR_: NPN TRANSISTOR
U1 U3 U4 = OLIMEX_IC:RCLAMP0524P
U2 = OLIMEX_IC:MCP2562
U5 U13 = OLIMEX_IC:SY7208
U6 = OLIMEX_IC:MP1584
U7 U8 U10 U12 = OLIMEX_IC:SY6280
U9 = OLIMEX_IC:RTL8723BS(COMBO_MODULE)
U11 = OLIMEX_IC:BD5230G-TR: Rohm's BD52xx and BD53xx series are highly accurate, low current consumption Voltage Detector ICs with a capacitor-controlled time delay.
U14 = gogo:RESET: Microcontroller Supervisory Circuit with Open Drain Output
UEXT-1 UEXT-2 = con-harting-ml:ML10: HARTING
USB2.0_HOST = OLIMEX_CONNECTORS:USB_TWO_LEVEL
USB2.0_OTG = OLIMEX_CONNECTORS:MINI_USB9
USB_MICRO_3.0-AB = OLIMEX_CONNECTORS:USB_MICRO_3.0
VGA_DB15-F = OLIMEX_CONNECTORS:DB15
VR1-VR3 = OLIMEX_DISCRET:AP1231